# Altium project iMX53_BB_V1I2.PrjPcb (part 2 of 2)

## Sheet [08] - MMC SLOT.SchDoc: IMXBB
size A3; DocumentNumber: 8; Revision: 2.0; SheetNumber: 8; SheetTotal: 13
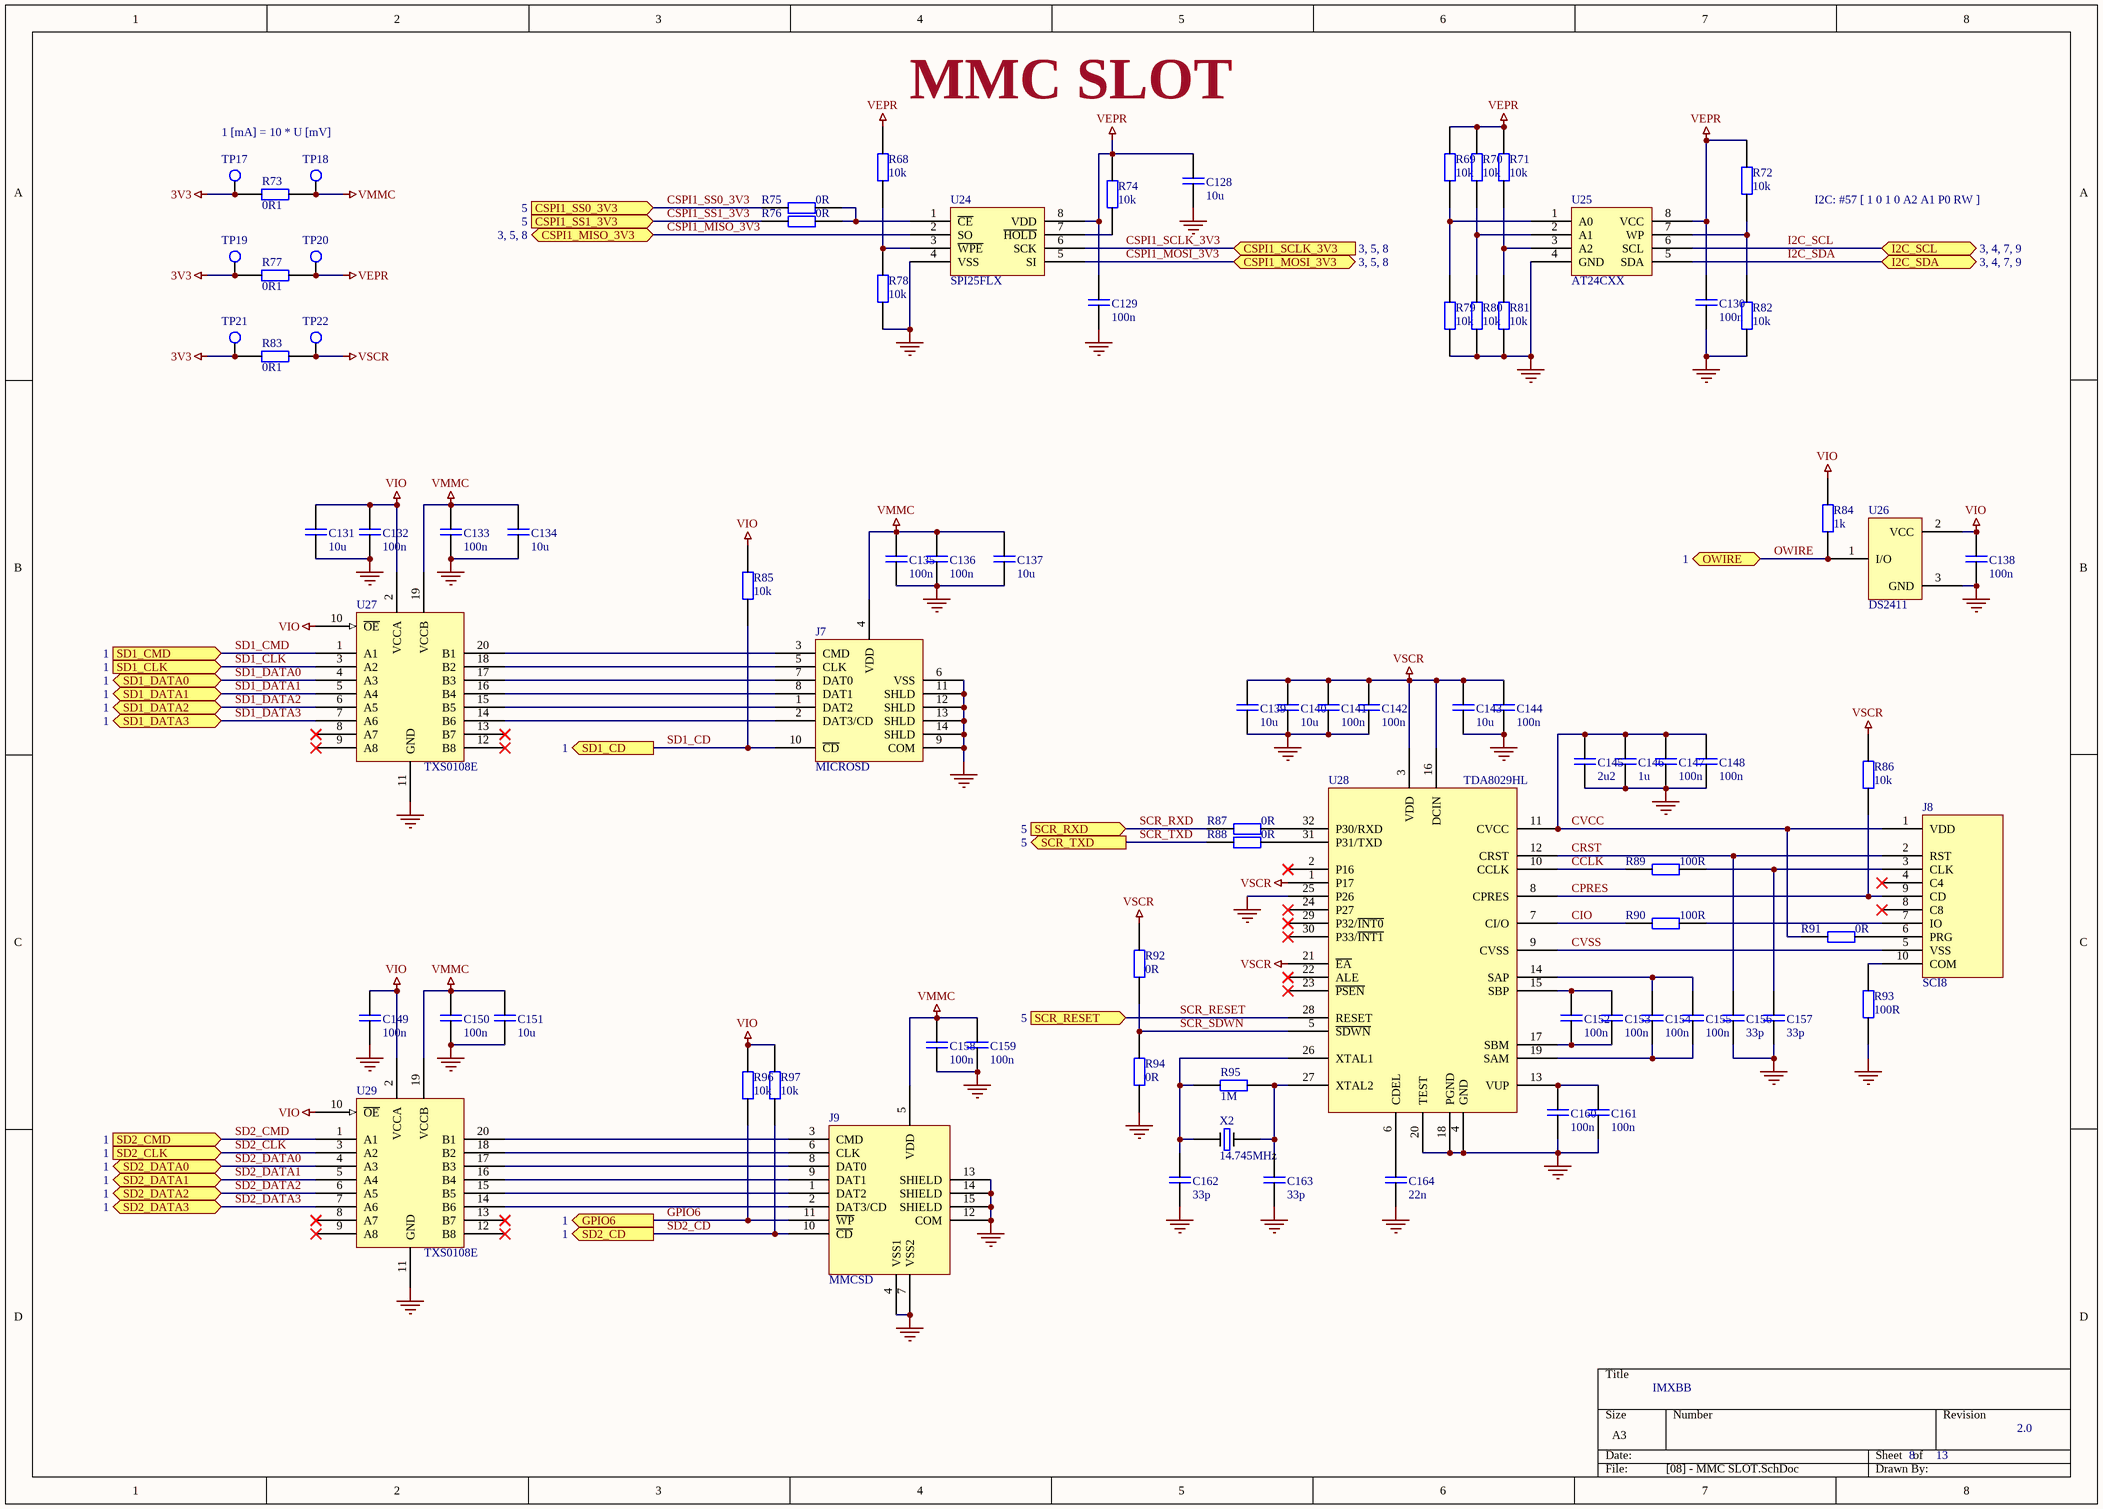
[diagram p8: [08] - MMC SLOT.SchDoc]

### Parts
C128  10u  [0805]
C129  100n  [0603]
C130  100n  [0603]
C131  10u  [0805]
C132  100n  [0603]
C133  100n  [0603]
C134  10u  [0805]
C135  100n  [0603]
C136  100n  [0603]
C137  10u  [0805]
C138  100n  [0603]
C139  10u  [0805]
C140  10u  [0805]
C141  100n  [0603]
C142  100n  [0603]
C143  10u  [0805]
C144  100n  [0603]
C145  2u2  [0603]
C146  1u  [0603]
C147  100n  [0603]
C148  100n  [0603]
C149  100n  [0603]
C150  100n  [0603]
C151  10u  [0805]
C152  100n  [0603]
C153  100n  [0603]
C154  100n  [0603]
C155  100n  [0603]
C156  33p  [0603]
C157  33p  [0603]
C158  100n  [0603]
C159  100n  [0603]
C160  100n  [0603]
C161  100n  [0603]
C162  33p  [0603]
C163  33p  [0603]
C164  22n  [0603]
J7  MICROSD  [uSD10]
J8  SCI8  [SCI8F]
J9  MMCSD  [SDCMF-109]
R68  10k  [0603]
R69  10k  [0603]
R70  10k  [0603]
R71  10k  [0603]
R72  10k  [0603]
R73  0R1  [0603]
R74  10k  [0603]
R75  0R  [0603]
R76  0R  [0603]
R77  0R1  [0603]
R78  10k  [0603]
R79  10k  [0603]
R80  10k  [0603]
R81  10k  [0603]
R82  10k  [0603]
R83  0R1  [0603]
R84  1k  [0603]
R85  10k  [0603]
R86  10k  [0603]
R87  0R  [0603]
R88  0R  [0603]
R89  100R  [0603]
R90  100R  [0603]
R91  0R  [0603]
R92  0R  [0603]
R93  100R  [0603]
R94  0R  [0603]
R95  1M  [0603]
R96  10k  [0603]
R97  10k  [0603]
TP17  TESTPOINT  [TESTPOINT_2mm]  (value not drawn)
TP18  TESTPOINT  [TESTPOINT_2mm]  (value not drawn)
TP19  TESTPOINT  [TESTPOINT_2mm]  (value not drawn)
TP20  TESTPOINT  [TESTPOINT_2mm]  (value not drawn)
TP21  TESTPOINT  [TESTPOINT_2mm]  (value not drawn)
TP22  TESTPOINT  [TESTPOINT_2mm]  (value not drawn)
U24  SPI25FLX  [SOIC8]
U25  AT24CXX  [SOIC8]
U26  DS2411  [SOT23]
U27  TXS0108E  [TSSOP20]
U28  TDA8029HL  [LQFP32]
U29  TXS0108E  [TSSOP20]
X2  14.745MHz  [HC494H]

### Ports
CSPI1_MISO_3V3 (bidir, see 3, 5, 8), CSPI1_MOSI_3V3 (bidir, see 3, 5, 8), CSPI1_SCLK_3V3 (in, see 3, 5, 8), CSPI1_SS0_3V3 (in, see 5), CSPI1_SS1_3V3 (in, see 5), GPIO6 (out, see 1), I2C_SCL (bidir, see 3, 4, 7, 9), I2C_SDA (bidir, see 3, 4, 7, 9), OWIRE (bidir, see 1), SCR_RESET (in, see 5), SCR_RXD (in, see 5), SCR_TXD (out, see 5), SD1_CD (out, see 1), SD1_CLK (in, see 1), SD1_CMD (in, see 1), SD1_DATA0 (bidir, see 1), SD1_DATA1 (bidir, see 1), SD1_DATA2 (bidir, see 1), SD1_DATA3 (bidir, see 1), SD2_CD (out, see 1), SD2_CLK (in, see 1), SD2_CMD (in, see 1), SD2_DATA0 (bidir, see 1), SD2_DATA1 (bidir, see 1), SD2_DATA2 (bidir, see 1), SD2_DATA3 (bidir, see 1)

### Nets
3V3: R73.1 R77.1 R83.1 TP17.1 TP19.1 TP21.1
GND: C128.1 C129.1 C130.1 C131.1 C132.1 C133.1 C134.1 C135.1 C136.1 C137.1 C138.1 C139.1 C140.1 C141.1 C142.1 C143.1 C144.1 C145.1 C146.1 C147.1 C148.1 C149.1 C150.1 C151.1 C156.1 C157.1 C158.1 C159.1 C160.1 C161.1 C162.1 C163.1 C164.1 J7.6(VSS) J7.9(COM) J7.11(SHLD) J7.12(SHLD) J7.13(SHLD) J7.14(SHLD) J9.4(VSS1) J9.7(VSS2) J9.12(COM) J9.13(SHIELD) J9.14(SHIELD) J9.15(SHIELD) R78.2 R79.2 R80.2 R81.2 R82.2 R93.1 R94.1 U24.4(VSS) U25.4(GND) U26.3(GND) U27.11(GND) U28.4(GND) U28.18(PGND) U28.20(TEST) U28.25(P26) U29.11(GND)
VEPR: C128.2 C129.2 C130.2 R68.1 R69.1 R70.1 R71.1 R72.1 R74.1 R77.2 TP20.1 U24.8(VDD) U25.8(VCC)
VIO: C131.2 C132.2 C138.2 C149.2 R84.1 R85.1 R96.1 R97.1 U26.2(VCC) U27.2(VCCA) U27.10(~{OE}) U29.2(VCCA) U29.10(~{OE})
VMMC: C133.2 C134.2 C135.2 C136.2 C137.2 C150.2 C151.2 C158.2 C159.2 J7.4(VDD) J9.5(VDD) R73.2 TP18.1 U27.19(VCCB) U29.19(VCCB)
VSCR: C139.2 C140.2 C141.2 C142.2 C143.2 C144.2 R83.2 R86.2 R92.2 TP22.1 U28.1(P17) U28.3(VDD) U28.16(DCIN) U28.21(~{EA})
CCLK: R89.1 U28.10(CCLK)
CIO: R90.1 U28.7(CI/O)
CPRES: J8.9(CD) R86.1 U28.8(CPRES)
CRST: C156.2 J8.2(RST) U28.12(CRST)
CSPI1_MISO_3V3: U24.2(SO) ; port CSPI1_MISO_3V3
CSPI1_MOSI_3V3: U24.5(SI) ; port CSPI1_MOSI_3V3
CSPI1_SCLK_3V3: U24.6(SCK) ; port CSPI1_SCLK_3V3
CSPI1_SS0_3V3: R75.1 ; port CSPI1_SS0_3V3
CSPI1_SS1_3V3: R76.1 ; port CSPI1_SS1_3V3
CVCC: C145.2 C146.2 C147.2 C148.2 J8.1(VDD) R91.1 U28.11(CVCC)
CVSS: J8.5(VSS) U28.9(CVSS)
GPIO6: J9.11(~{WP}) R96.2 ; port GPIO6
I2C_SCL: U25.6(SCL) ; port I2C_SCL
I2C_SDA: U25.5(SDA) ; port I2C_SDA
OWIRE: R84.2 U26.1(I/O) ; port OWIRE
SCR_RESET: U28.28(RESET) ; port SCR_RESET
SCR_RXD: R87.1 ; port SCR_RXD
SCR_SDWN: R92.1 R94.2 U28.5(~{SDWN})
SCR_TXD: R88.1 ; port SCR_TXD
SD1_CD: J7.10(~{CD}) R85.2 ; port SD1_CD
SD1_CLK: U27.3(A2) ; port SD1_CLK
SD1_CMD: U27.1(A1) ; port SD1_CMD
SD1_DATA0: U27.4(A3) ; port SD1_DATA0
SD1_DATA1: U27.5(A4) ; port SD1_DATA1
SD1_DATA2: U27.6(A5) ; port SD1_DATA2
SD1_DATA3: U27.7(A6) ; port SD1_DATA3
SD2_CD: J9.10(~{CD}) R97.2 ; port SD2_CD
SD2_CLK: U29.3(A2) ; port SD2_CLK
SD2_CMD: U29.1(A1) ; port SD2_CMD
SD2_DATA0: U29.4(A3) ; port SD2_DATA0
SD2_DATA1: U29.5(A4) ; port SD2_DATA1
SD2_DATA2: U29.6(A5) ; port SD2_DATA2
SD2_DATA3: U29.7(A6) ; port SD2_DATA3
NetC152_1: C152.1 C153.1 U28.17(SBM)
NetC152_2: C152.2 C153.2 U28.15(SBP)
NetC154_1: C154.1 C155.1 U28.19(SAM)
NetC154_2: C154.2 C155.2 U28.14(SAP)
NetC157_2: C157.2 J8.3(CLK) R89.2
NetC160_2: C160.2 C161.2 U28.13(VUP)
NetC162_2: C162.2 R95.2 U28.26(XTAL1) X2.1
NetC163_2: C163.2 R95.1 U28.27(XTAL2) X2.2
NetC164_2: C164.2 U28.6(CDEL)
NetJ7_1: J7.1(DAT2) U27.15(B5)
NetJ7_2: J7.2(DAT3/CD) U27.14(B6)
NetJ7_3: J7.3(CMD) U27.20(B1)
NetJ7_5: J7.5(CLK) U27.18(B2)
NetJ7_7: J7.7(DAT0) U27.17(B3)
NetJ7_8: J7.8(DAT1) U27.16(B4)
NetJ8_6: J8.6(PRG) R91.2
NetJ8_7: J8.7(IO) R90.2
NetJ8_10: J8.10(COM) R93.2
NetJ9_1: J9.1(DAT2) U29.15(B5)
NetJ9_2: J9.2(DAT3/CD) U29.14(B6)
NetJ9_3: J9.3(CMD) U29.20(B1)
NetJ9_6: J9.6(CLK) U29.18(B2)
NetJ9_8: J9.8(DAT0) U29.17(B3)
NetJ9_9: J9.9(DAT1) U29.16(B4)
NetR68_2: R68.2 R78.1 U24.3(~{WPE})
NetR69_2: R69.2 R79.1 U25.1(A0)
NetR70_2: R70.2 R80.1 U25.2(A1)
NetR71_2: R71.2 R81.1 U25.3(A2)
NetR72_2: R72.2 R82.1 U25.7(WP)
NetR74_2: R74.2 U24.7(~{HOLD})
NetR75_2: R75.2 R76.2 U24.1(~{CE})
NetR87_2: R87.2 U28.32(P30/RXD)
NetR88_2: R88.2 U28.31(P31/TXD)

Not connected (* = marked no-connect by the designer): J8 4(C4)* 8(C8)*; U27 8(A7)* 9(A8)* 12(B8)* 13(B7)*; U28 2(P16)* 22(ALE)* 23(~{PSEN})* 24(P27)* 29(P32/~{INT0})* 30(P33/~{INT1})*; U29 8(A7)* 9(A8)* 12(B8)* 13(B7)*

### Notes on the sheet
- MMC SLOT
- 1 [mA] = 10 * U [mV]
- I2C: #57 [ 1 0 1 0 A2 A1 P0 RW ]

### Library data of the parts
C128-C164 = C
R68-R97 = R
TP17-TP22 = TESTPOINT: as TP1 on sheet [03] - DIMM CON; Component class: TP; Producer: n/a; Assembly type: no component
X2 = XTAL

## Sheet [09] - DVI.SchDoc: IMXBB
size A3; DocumentNumber: 9; Revision: 2.0; SheetNumber: 9; SheetTotal: 13
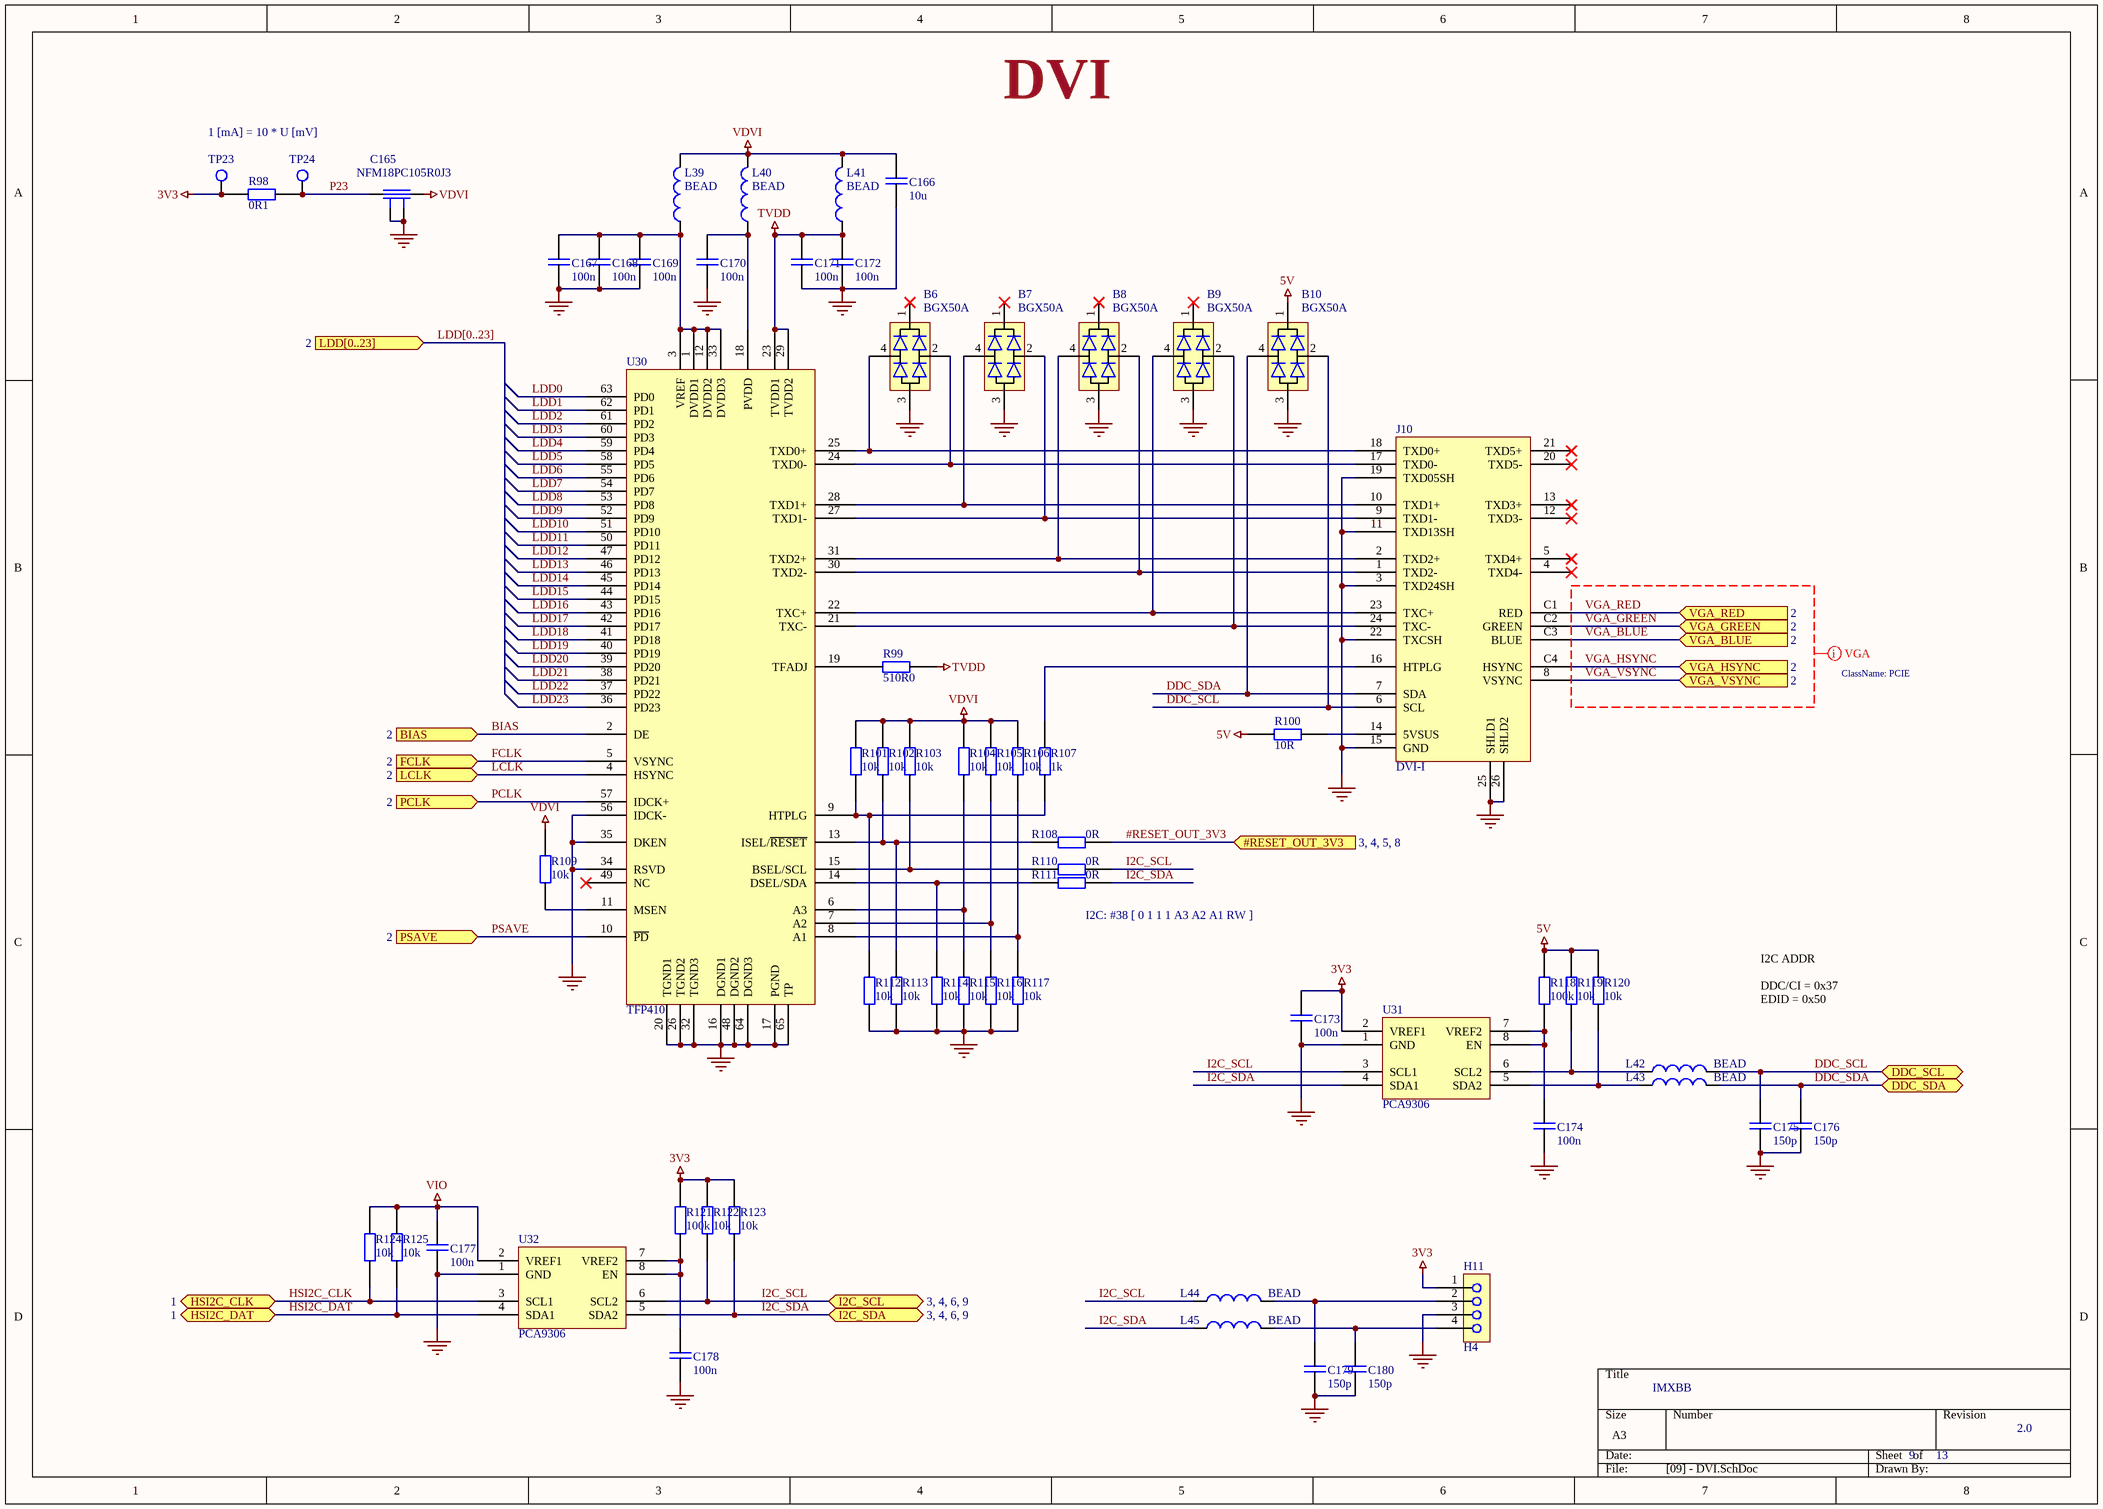
[diagram p9: [09] - DVI.SchDoc]

### Parts
B6  BGX50A  [SOT143]
B7  BGX50A  [SOT143]
B8  BGX50A  [SOT143]
B9  BGX50A  [SOT143]
B10  BGX50A  [SOT143]
C165  NFM18PC105R0J3  [NFM18P]
C166  10u  [0805]
C167  100n  [0603]
C168  100n  [0603]
C169  100n  [0603]
C170  100n  [0603]
C171  100n  [0603]
C172  100n  [0603]
C173  100n  [0603]
C174  100n  [0603]
C175  150p  [0603]
C176  150p  [0603]
C177  100n  [0603]
C178  100n  [0603]
C179  150p  [0603]
C180  150p  [0603]
H11  H4  [H1x4]
J10  DVI-I  [DVI_F_RA]
L39  BEAD  [0603]
L40  BEAD  [0603]
L41  BEAD  [0603]
L42  BEAD  [0603]
L43  BEAD  [0603]
L44  BEAD  [0603]
L45  BEAD  [0603]
R98  0R1  [0603]
R99  510R0  [0603]
R100  10R  [0603]
R101  10k  [0603]
R102  10k  [0603]
R103  10k  [0603]
R104  10k  [0603]
R105  10k  [0603]
R106  10k  [0603]
R107  1k  [0603]
R108  0R  [0603]
R109  10k  [0603]
R110  0R  [0603]
R111  0R  [0603]
R112  10k  [0603]
R113  10k  [0603]
R114  10k  [0603]
R115  10k  [0603]
R116  10k  [0603]
R117  10k  [0603]
R118  100k  [0603]
R119  10k  [0603]
R120  10k  [0603]
R121  100k  [0603]
R122  10k  [0603]
R123  10k  [0603]
R124  10k  [0603]
R125  10k  [0603]
TP23  TESTPOINT  [TESTPOINT_2mm]  (value not drawn)
TP24  TESTPOINT  [TESTPOINT_2mm]  (value not drawn)
U30  TFP410  [TQFP64]
U31  PCA9306  [TSSOP8]
U32  PCA9306  [TSSOP8]

### Ports
#RESET_OUT_3V3 (in, see 3, 4, 5, 8), BIAS (in, see 2), DDC_SCL (bidir), DDC_SDA (bidir), FCLK (in, see 2), HSI2C_CLK (bidir, see 1), HSI2C_DAT (bidir, see 1), I2C_SCL (bidir, see 3, 4, 6, 9), I2C_SDA (bidir, see 3, 4, 6, 9), LCLK (in, see 2), LDD[0..23] (in, see 2), PCLK (in, see 2), PSAVE (in, see 2), VGA_BLUE (in, see 2), VGA_GREEN (in, see 2), VGA_HSYNC (in, see 2), VGA_RED (in, see 2), VGA_VSYNC (in, see 2)

### Nets
3V3: C173.2 H11.1 R98.1 R121.1 R122.1 R123.1 TP23.1 U31.2(VREF1)
5V: B10.1 R100.2 R118.1 R119.1 R120.1
GND: B6.3 B7.3 B8.3 B9.3 B10.3 C165.2 C165.4 C166.1 C167.1 C168.1 C169.1 C170.1 C171.1 C172.1 C173.1 C174.1 C175.1 C176.1 C177.1 C178.1 C179.1 C180.1 H11.3 J10.3(TXD24SH) J10.11(TXD13SH) J10.15(GND) J10.19(TXD05SH) J10.22(TXCSH) J10.25(SHLD1) J10.26(SHLD2) R112.2 R113.2 R114.1 R115.2 R116.2 R117.2 U30.16(DGND1) U30.17(PGND) U30.20(TGND1) U30.26(TGND2) U30.32(TGND3) U30.34(RSVD) U30.35(DKEN) U30.48(DGND2) U30.56(IDCK-) U30.64(DGND3) U30.65(TP) U31.1(GND) U32.1(GND)
TVDD: C171.2 C172.2 L41.1 R99.1 U30.23(TVDD1) U30.29(TVDD2)
VDVI: C165.3 C166.2 L39.2 L40.2 L41.2 R101.1 R102.1 R103.1 R104.1 R105.1 R106.1 R109.1
VIO: C177.2 R124.1 R125.1 U32.2(VREF1)
#RESET_OUT_3V3: R108.1 ; port #RESET_OUT_3V3
BIAS: U30.2(DE) ; port BIAS
DDC_SCL: B10.2 C175.2 J10.6(SCL) L42.2 ; port DDC_SCL
DDC_SDA: B10.4 C176.2 J10.7(SDA) L43.2 ; port DDC_SDA
FCLK: U30.5(VSYNC) ; port FCLK
HSI2C_CLK: R124.2 U32.3(SCL1) ; port HSI2C_CLK
HSI2C_DAT: R125.2 U32.4(SDA1) ; port HSI2C_DAT
I2C_SCL: L44.1 R110.1 R122.2 U31.3(SCL1) U32.6(SCL2) ; port I2C_SCL
I2C_SDA: L45.1 R111.1 R123.2 U31.4(SDA1) U32.5(SDA2) ; port I2C_SDA
LCLK: U30.4(HSYNC) ; port LCLK
LDD0: U30.63(PD0)
LDD1: U30.62(PD1)
LDD2: U30.61(PD2)
LDD3: U30.60(PD3)
LDD4: U30.59(PD4)
LDD5: U30.58(PD5)
LDD6: U30.55(PD6)
LDD7: U30.54(PD7)
LDD8: U30.53(PD8)
LDD9: U30.52(PD9)
LDD10: U30.51(PD10)
LDD11: U30.50(PD11)
LDD12: U30.47(PD12)
LDD13: U30.46(PD13)
LDD14: U30.45(PD14)
LDD15: U30.44(PD15)
LDD16: U30.43(PD16)
LDD17: U30.42(PD17)
LDD18: U30.41(PD18)
LDD19: U30.40(PD19)
LDD20: U30.39(PD20)
LDD21: U30.38(PD21)
LDD22: U30.37(PD22)
LDD23: U30.36(PD23)
P23: C165.1 R98.2 TP24.1
PCLK: U30.57(IDCK+) ; port PCLK
PSAVE: U30.10(~{PD}) ; port PSAVE
VGA_BLUE: J10.C3(BLUE) ; port VGA_BLUE
VGA_GREEN: J10.C2(GREEN) ; port VGA_GREEN
VGA_HSYNC: J10.C4(HSYNC) ; port VGA_HSYNC
VGA_RED: J10.C1(RED) ; port VGA_RED
VGA_VSYNC: J10.8(VSYNC) ; port VGA_VSYNC
NetB6_2: B6.2 J10.17(TXD0-) U30.24(TXD0-)
NetB6_4: B6.4 J10.18(TXD0+) U30.25(TXD0+)
NetB7_2: B7.2 J10.9(TXD1-) U30.27(TXD1-)
NetB7_4: B7.4 J10.10(TXD1+) U30.28(TXD1+)
NetB8_2: B8.2 J10.1(TXD2-) U30.30(TXD2-)
NetB8_4: B8.4 J10.2(TXD2+) U30.31(TXD2+)
NetB9_2: B9.2 J10.24(TXC-) U30.21(TXC-)
NetB9_4: B9.4 J10.23(TXC+) U30.22(TXC+)
NetC167_2: C167.2 C168.2 C169.2 L39.1 U30.1(DVDD1) U30.3(VREF) U30.12(DVDD2) U30.33(DVDD3)
NetC170_2: C170.2 L40.1 U30.18(PVDD)
NetC174_2: C174.2 R118.2 U31.7(VREF2) U31.8(EN)
NetC178_2: C178.2 R121.2 U32.7(VREF2) U32.8(EN)
NetC179_2: C179.2 H11.2 L44.2
NetC180_2: C180.2 H11.4 L45.2
NetJ10_14: J10.14(5VSUS) R100.1
NetJ10_16: J10.16(HTPLG) R107.1
NetL42_1: L42.1 R119.2 U31.6(SCL2)
NetL43_1: L43.1 R120.2 U31.5(SDA2)
NetR99_2: R99.2 U30.19(TFADJ)
NetR101_2: R101.2 R107.2 R112.1 U30.9(HTPLG)
NetR102_2: R102.2 R108.2 R113.1 U30.13(ISEL/~{RESET})
NetR103_2: R103.2 R110.2 U30.15(BSEL/SCL)
NetR104_2: R104.2 R115.1 U30.6(A3)
NetR105_2: R105.2 R116.1 U30.7(A2)
NetR106_2: R106.2 R117.1 U30.8(A1)
NetR109_2: R109.2 U30.11(MSEN)
NetR111_2: R111.2 R114.2 U30.14(DSEL/SDA)

Not connected (* = marked no-connect by the designer): B6 1*; B7 1*; B8 1*; B9 1*; J10 4(TXD4-)* 5(TXD4+)* 12(TXD3-)* 13(TXD3+)* 20(TXD5-)* 21(TXD5+)*; U30 49(NC)*

### Buses and harness runs
bus LDD[0..23] = port LDD[0..23]

### Layout directives
net class PCIE: VGA_BLUE, VGA_GREEN, VGA_HSYNC, VGA_RED, VGA_VSYNC

### Notes on the sheet
- DVI
- 1 [mA] = 10 * U [mV]
- I2C: #38 [ 0 1 1 1 A3 A2 A1 RW ]
- I2C ADDR
  DDC/CI	= 0x37
  EDID	= 0x50

### Library data of the parts
C165 = NFL21S: Chip EMIFIL; Producer: Murata; Order number: NFM18PC105R0J3; Component class: C; Assembly type: SMT
C166-C180 = C
L39-L45 = FBEAD
R98-R125 = R
TP23 TP24 = TESTPOINT: Testpoint pad; Order number: no component; Component class: TP; Producer: n/a; Assembly type: no component

## Sheet [10] - ETHERNET.SchDoc: IMXBB
size A3; DocumentNumber: 10; Revision: 2.0; SheetNumber: 10; SheetTotal: 13
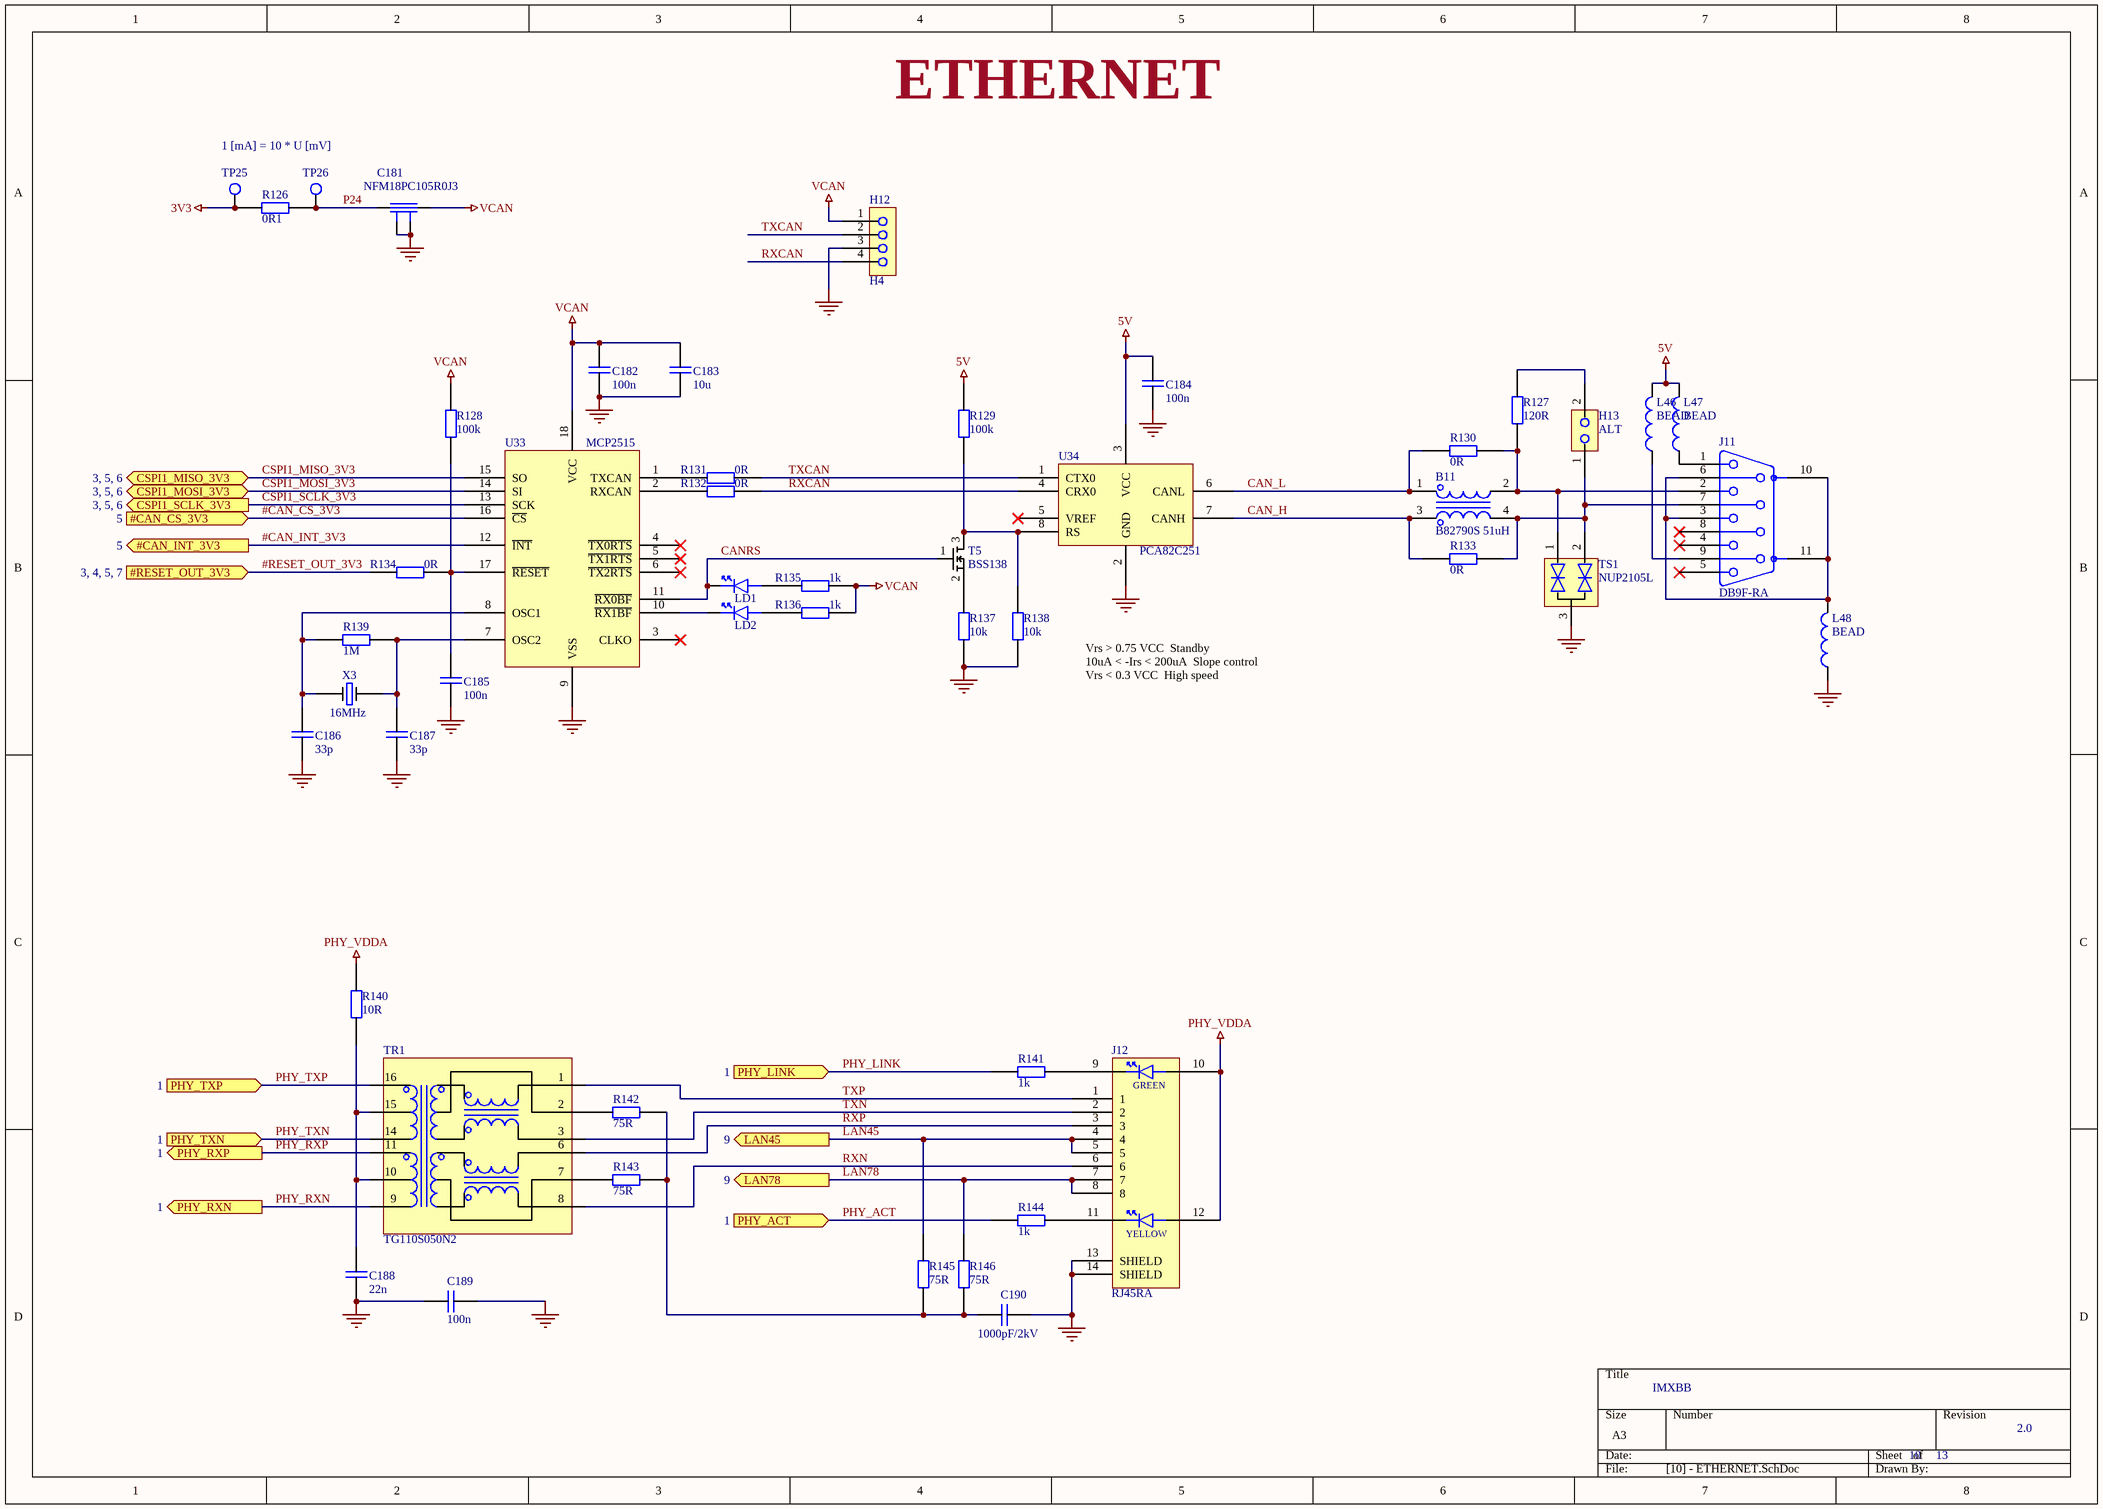
[diagram p10: [10] - ETHERNET.SchDoc]

### Parts
B11  B82790S 51uH  [B82790]
C181  NFM18PC105R0J3  [NFM18P]
C182  100n  [0603]
C183  10u  [0805]
C184  100n  [0603]
C185  100n  [0603]
C186  33p  [0603]
C187  33p  [0603]
C188  22n  [0603]
C189  100n  [0603]
C190  1000pF/2kV  [1n]
H12  H4  [H1x4]
H13  ALT  [H1x2]
J11  DB9F-RA  [DRA9_F]
J12  RJ45RA  [RJ45LED]
L46  BEAD  [0805]
L47  BEAD  [0805]
L48  BEAD  [0603]
LD1  LED  [0805]  (value not drawn)
LD2  LED  [0805]  (value not drawn)
R126  0R1  [0603]
R127  120R  [0603]
R128  100k  [0603]
R129  100k  [0603]
R130  0R  [0603]
R131  0R  [0603]
R132  0R  [0603]
R133  0R  [0603]
R134  0R  [0603]
R135  1k  [0603]
R136  1k  [0603]
R137  10k  [0603]
R138  10k  [0603]
R139  1M  [0603]
R140  10R  [0603]
R141  1k  [0603]
R142  75R  [0603]
R143  75R  [0603]
R144  1k  [0603]
R145  75R  [0603]
R146  75R  [0603]
T5  BSS138  [SOT23]
TP25  TESTPOINT  [TESTPOINT_2mm]  (value not drawn)
TP26  TESTPOINT  [TESTPOINT_2mm]  (value not drawn)
TR1  TG110S050N2  [SOIC16M]
TS1  NUP2105L  [SOT23]
U33  MCP2515  [SOIC18W]
U34  PCA82C251  [SOIC8N]
X3  16MHz  [HC494H]

### Ports
#CAN_CS_3V3 (in, see 5), #CAN_INT_3V3 (out, see 5), #RESET_OUT_3V3 (in, see 3, 4, 5, 7), CSPI1_MISO_3V3 (bidir, see 3, 5, 6), CSPI1_MOSI_3V3 (bidir, see 3, 5, 6), CSPI1_SCLK_3V3 (out, see 3, 5, 6), LAN45 (out, see 9), LAN78 (out, see 9), PHY_ACT (in, see 1), PHY_LINK (in, see 1), PHY_RXN (out, see 1), PHY_RXP (out, see 1), PHY_TXN (in, see 1), PHY_TXP (in, see 1)

### Nets
3V3: R126.1 TP25.1
5V: C184.2 L46.2 L47.2 R129.1 U34.3(VCC)
CASE_GND: C189.1 C190.2 J12.13(SHIELD) J12.14(SHIELD)
GND: C181.2 C181.4 C182.1 C183.1 C184.1 C185.1 C186.1 C187.1 C188.1 C189.2 H12.3 L48.1 R137.2 R138.2 TS1.3 U33.9(VSS) U34.2(GND)
PHY_VDDA: J12.10(D1P) J12.12(D2P) R140.2
VCAN: C181.3 C182.2 C183.2 H12.1 R128.1 R135.1 R136.1 U33.18(VCC)
#CAN_CS_3V3: U33.16(~{CS}) ; port #CAN_CS_3V3
#CAN_INT_3V3: U33.12(~{INT}) ; port #CAN_INT_3V3
#RESET_OUT_3V3: R134.2 ; port #RESET_OUT_3V3
CAN_H: B11.3 R133.1 U34.7(CANH)
CAN_L: B11.1 R130.1 U34.6(CANL)
CANRS: LD1.2(CATHODE) T5.1(G) U33.11(~{RX0BF})
CSPI1_MISO_3V3: U33.15(SO) ; port CSPI1_MISO_3V3
CSPI1_MOSI_3V3: U33.14(SI) ; port CSPI1_MOSI_3V3
CSPI1_SCLK_3V3: U33.13(SCK) ; port CSPI1_SCLK_3V3
LAN45: J12.4 J12.5 R145.2 ; port LAN45
LAN78: J12.7 J12.8 R146.2 ; port LAN78
P24: C181.1 R126.2 TP26.1
PHY_ACT: R144.1 ; port PHY_ACT
PHY_LINK: R141.1 ; port PHY_LINK
PHY_RXN: TR1.9(P10) ; port PHY_RXN
PHY_RXP: TR1.11(P12) ; port PHY_RXP
PHY_TXN: TR1.14(P14) ; port PHY_TXN
PHY_TXP: TR1.16(P16) ; port PHY_TXP
RXCAN: H12.4 R132.1 U34.4(CRX0)
RXN: J12.6 TR1.8(P8)
RXP: J12.3 TR1.6(P6)
TXCAN: H12.2 R131.1 U34.1(CTX0)
TXN: J12.2 TR1.3(P3)
TXP: J12.1 TR1.1(P1)
NetB11_2: B11.2 J11.2 R127.2 R130.2 TS1.1
NetB11_4: B11.4 H13.1 J11.7 R133.2 TS1.2
NetC185_2: C185.2 R128.2 R134.1 U33.17(~{RESET})
NetC186_2: C186.2 R139.2 U33.8(OSC1) X3.1
NetC187_2: C187.2 R139.1 U33.7(OSC2) X3.2
NetC188_2: C188.2 R140.1 TR1.10(P11) TR1.15(CT)
NetC190_1: C190.1 R142.2 R143.2 R145.1 R146.1
NetH13_2: H13.2 R127.1
NetJ11_1: J11.1 L47.1
NetJ11_3: J11.3 J11.6 J11.10(SHIELD) J11.11(SHIELD) L48.2
NetJ11_9: J11.9 L46.1
NetJ12_9: J12.9(D1N) R141.2
NetJ12_11: J12.11(D2N) R144.2
NetLD1_1: LD1.1(ANODE) R135.2
NetLD2_1: LD2.1(ANODE) R136.2
NetLD2_2: LD2.2(CATHODE) U33.10(~{RX1BF})
NetR129_2: R129.2 R138.1 T5.3(D) U34.8(RS)
NetR131_2: R131.2 U33.1(TXCAN)
NetR132_2: R132.2 U33.2(RXCAN)
NetR137_1: R137.1 T5.2(S)
NetR142_1: R142.1 TR1.2(P2)
NetR143_1: R143.1 TR1.7(P7)

Not connected (* = marked no-connect by the designer): J11 4* 5* 8*; U33 3(CLKO)* 4(~{TX0RTS})* 5(~{TX1RTS})* 6(~{TX2RTS})*; U34 5(VREF)*

### Notes on the sheet
- ETHERNET
- 1 [mA] = 10 * U [mV]
- Vrs > 0.75 VCC		Standby
  10uA < -Irs < 200uA		Slope control
  Vrs < 0.3 VCC		High speed
- (in symbol RJ45RA) GREEN; YELLOW

### Library data of the parts
B11 = B82790S: pin to pad: 3>4 4>3
C181 = NFL21S: Chip EMIFIL; Producer: Murata; Order number: NFM18PC105R0J3; Component class: C; Assembly type: SMT
C182-C190 = C
H13 = H2
L46-L48 = FBEAD
R126-R146 = R
TP25 TP26 = TESTPOINT: as TP23 on sheet [09] - DVI; Component class: TP; Producer: n/a; Assembly type: no component
X3 = XTAL

## Sheet [11] - POWERS.SchDoc: IMXBB
size A3; DocumentNumber: 11; Revision: 2.0; SheetNumber: 11; SheetTotal: 13
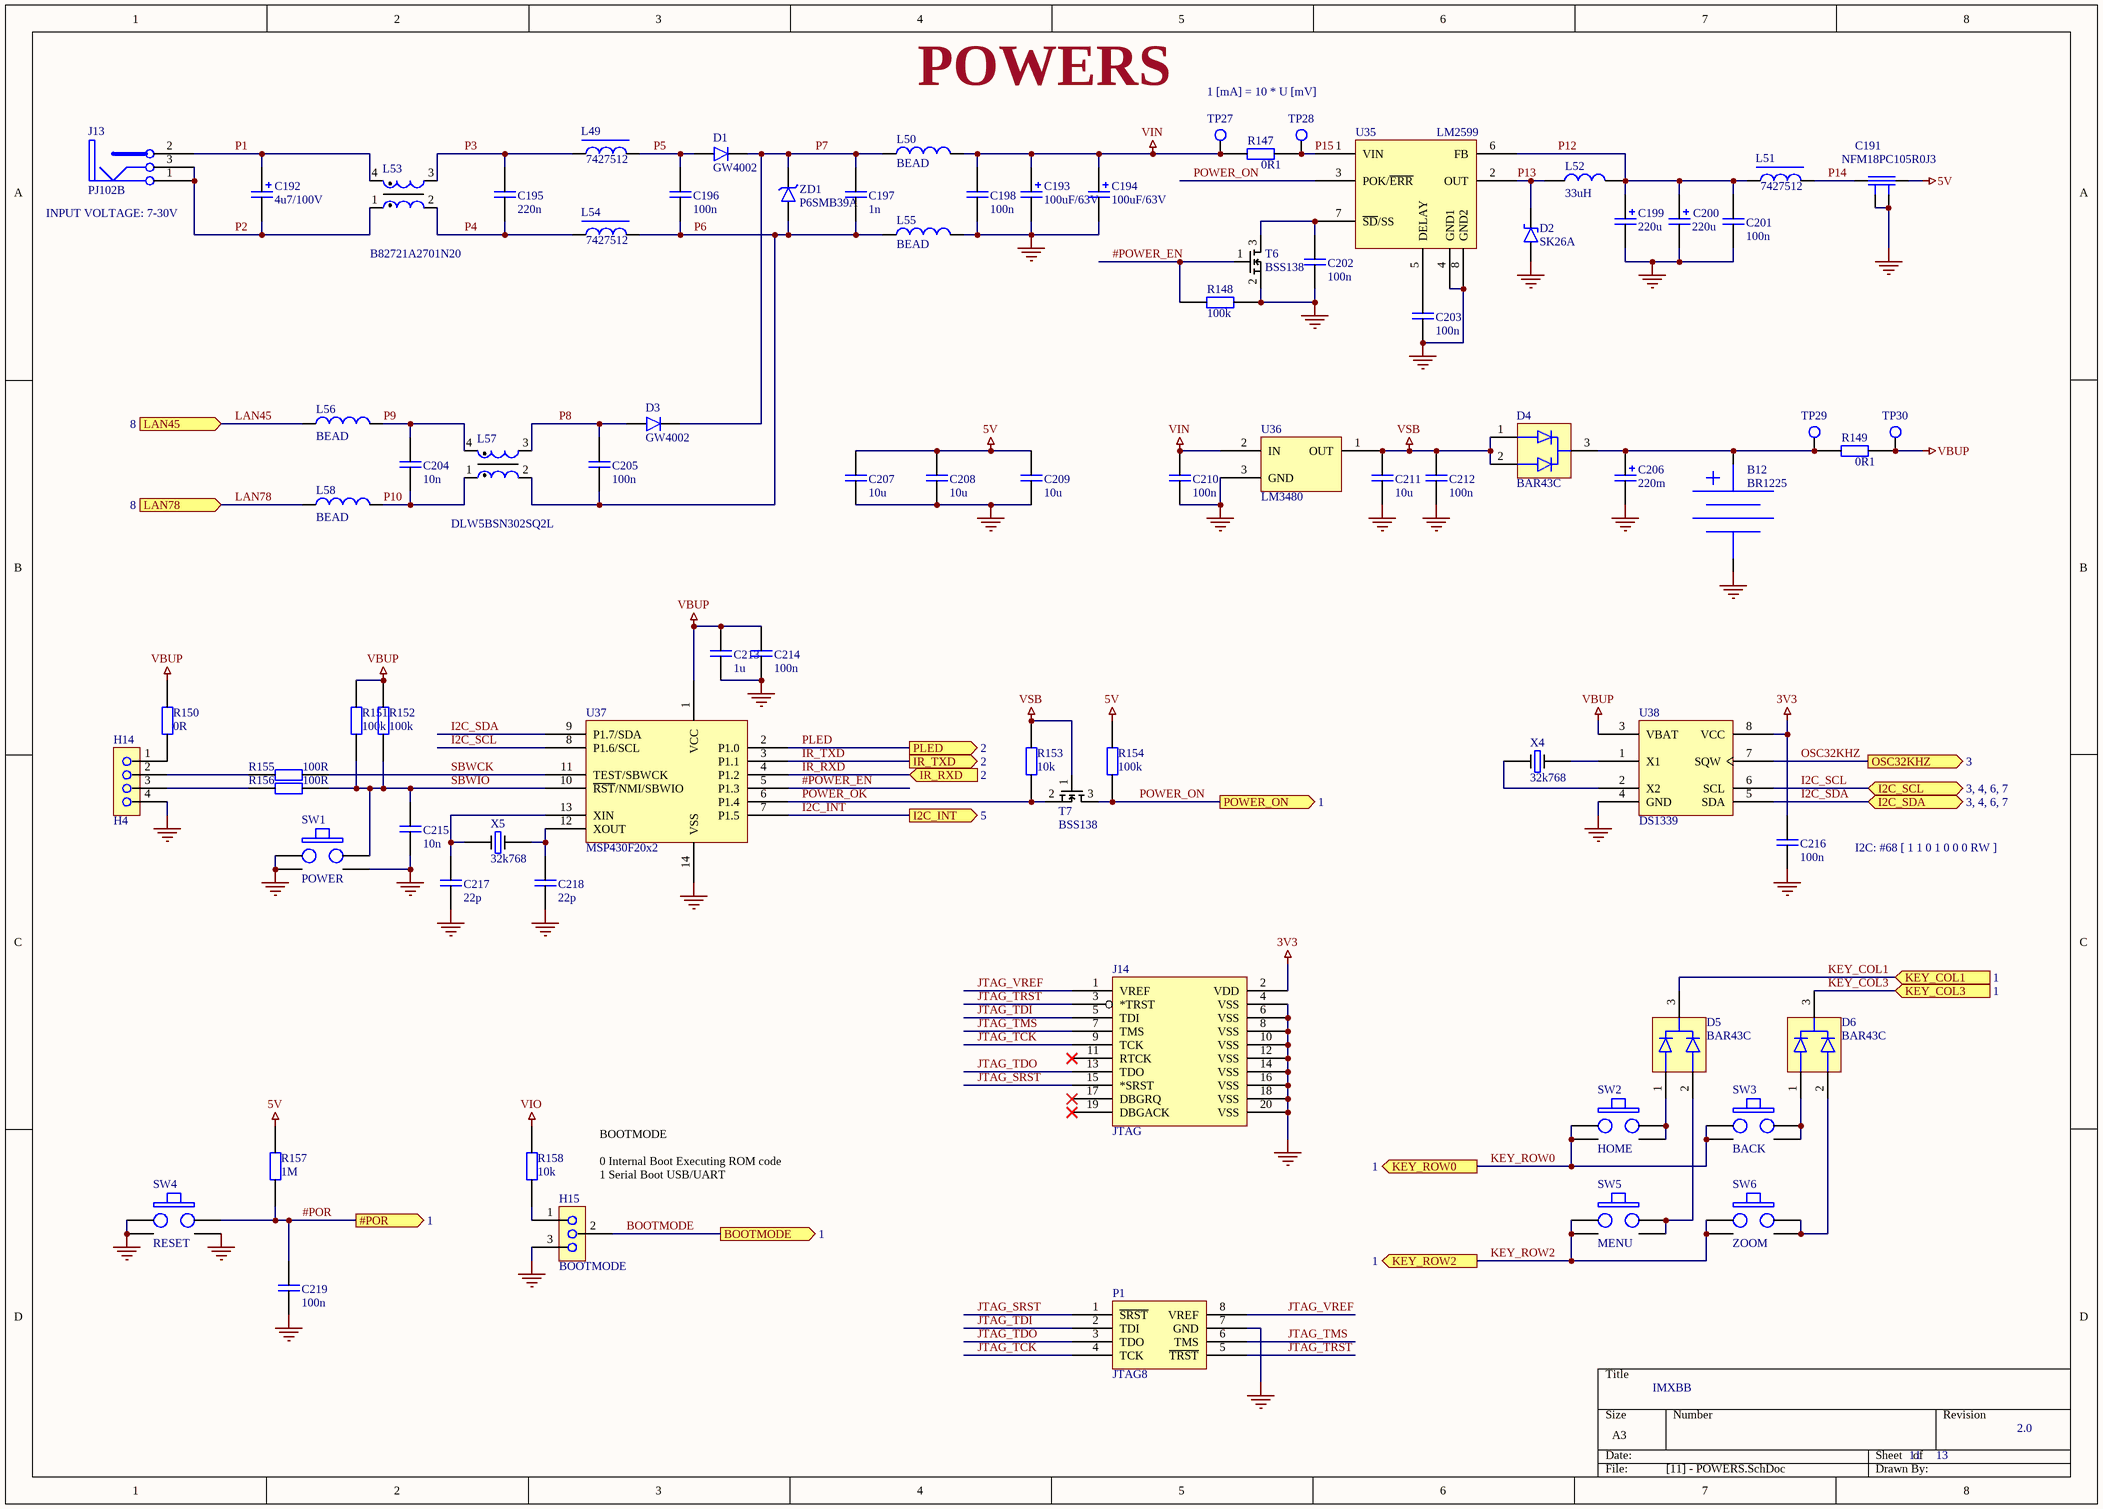
[diagram p11: [11] - POWERS.SchDoc]

### Parts
B12  BR1225  [BR1225]
C191  NFM18PC105R0J3  [NFM18P]
C192  4u7/100V  [EC2/5]
C193  100uF/63V  [EC5/10]
C194  100uF/63V  [EC5/10]
C195  220n  [1206]
C196  100n  [1206]
C197  1n  [0805]
C198  100n  [1206]
C199  220u  [EC5/10]
C200  220u  [EC5/10]
C201  100n  [0603]
C202  100n  [0603]
C203  100n  [0603]
C204  10n  [0603]
C205  100n  [0603]
C206  220m  [SC5/13]
C207  10u  [0805]
C208  10u  [0805]
C209  10u  [0805]
C210  100n  [0603]
C211  10u  [0805]
C212  100n  [0603]
C213  1u  [0603]
C214  100n  [0603]
C215  10n  [0603]
C216  100n  [0603]
C217  22p  [0603]
C218  22p  [0603]
C219  100n  [0603]
D1  GW4002  [MELF]
D2  SK26A  [SMB]
D3  GW4002  [MELF]
D4  BAR43C  [SOT23]
D5  BAR43C  [SOT23]
D6  BAR43C  [SOT23]
H14  H4  [H1x4]
H15  BOOTMODE  [H1x3]
J13  PJ102B  [POWER_JACK_5.5/2.1MM_NS]
J14  JTAG  [H2x10]
L49  7427512  [7427512]
L50  BEAD  [0805]
L51  7427512  [7427512]
L52  33uH  [L127_NS]
L53  B82721A2701N20  [42H17]
L54  7427512  [7427512]
L55  BEAD  [0805]
L56  BEAD  [0805]
L57  DLW5BSN302SQ2L  [DLW5BSN]
L58  BEAD  [0805]
P1  JTAG8  [47041-0001]
R147  0R1  [0603]
R148  100k  [0603]
R149  0R1  [0603]
R150  0R  [0603]
R151  100k  [0603]
R152  100k  [0603]
R153  10k  [0603]
R154  100k  [0603]
R155  100R  [0603]
R156  100R  [0603]
R157  1M  [0603]
R158  10k  [0603]
SW1  POWER  [BUTTON_RA_NS]
SW2  HOME  [BUTTON_KSM61X]
SW3  BACK  [BUTTON_KSM61X]
SW4  RESET  [BUTTON_RA_NS]
SW5  MENU  [BUTTON_KSM61X]
SW6  ZOOM  [BUTTON_KSM61X]
T6  BSS138  [SOT23]
T7  BSS138  [SOT23]
TP27  TESTPOINT  [TESTPOINT_2mm]  (value not drawn)
TP28  TESTPOINT  [TESTPOINT_2mm]  (value not drawn)
TP29  TESTPOINT  [TESTPOINT_2mm]  (value not drawn)
TP30  TESTPOINT  [TESTPOINT_2mm]  (value not drawn)
U35  LM2599  [TO263_7]
U36  LM3480  [SOT23]
U37  MSP430F20x2  [TSSOP14]
U38  DS1339  [uSOP8]
X4  32k768  [SMQ32S]
X5  32k768  [SMQ32S]
ZD1  P6SMB39A  [DO214AA]

### Ports
#POR (out, see 1), BOOTMODE (out, see 1), I2C_INT (out, see 5), I2C_SCL (bidir, see 3, 4, 6, 7), I2C_SDA (bidir, see 3, 4, 6, 7), IR_RXD (in, see 2), IR_TXD (out, see 2), KEY_COL1 (in, see 1), KEY_COL3 (in, see 1), KEY_ROW0 (out, see 1), KEY_ROW2 (out, see 1), LAN45 (in, see 8), LAN78 (in, see 8), OSC32KHZ (out, see 3), PLED (out, see 2), POWER_ON (out, see 1)

### Nets
3V3: C216.2 J14.2(VDD) U38.8(VCC)
5V: C191.3 C207.2 C208.2 C209.2 R154.2 R157.2
GND: B12.2(CATHODE) C191.2 C191.4 C193.2 C194.2 C198.2 C199.2 C200.2 C201.2 C202.1 C203.1 C206.2 C207.1 C208.1 C209.1 C210.1 C211.1 C212.1 C213.1 C214.2 C215.2 C216.1 C217.1 C218.1 C219.1 D2.2 H14.4 H15.3 J14.4(VSS) J14.6(VSS) J14.8(VSS) J14.10(VSS) J14.12(VSS) J14.14(VSS) J14.16(VSS) J14.18(VSS) J14.20(VSS) L55.1 P1.7(GND) R148.1 SW1.2 SW1.3 SW1.4 SW4.2 SW4.3 SW4.4 T6.2(S) U35.4(GND1) U35.8(GND2) U36.3(GND) U37.14(VSS) U38.4(GND)
VBUP: C213.2 C214.1 R149.2 R150.2 R151.2 R152.2 TP30.1 U37.1(VCC) U38.3(VBAT)
VIN: C193.1 C194.1 C198.1 C210.2 L50.1 R147.1 TP27.1 U36.2(IN)
VIO: R158.2
VSB: C211.2 C212.2 D4.1 D4.2 R153.1 T7.1(G) U36.1(OUT)
#POR: C219.2 R157.1 SW4.1 ; port #POR
#POWER_EN: R148.2 T6.1(G) U37.5(P1.3)
BOOTMODE: H15.2 ; port BOOTMODE
I2C_INT: U37.7(P1.5) ; port I2C_INT
I2C_SCL: U37.8(P1.6/SCL) U38.6(SCL) ; port I2C_SCL
I2C_SDA: U37.9(P1.7/SDA) U38.5(SDA) ; port I2C_SDA
IR_RXD: U37.4(P1.2) ; port IR_RXD
IR_TXD: U37.3(P1.1) ; port IR_TXD
JTAG_SRST: J14.15(*SRST) P1.1(~{SRST})
JTAG_TCK: J14.9(TCK) P1.4(TCK)
JTAG_TDI: J14.5(TDI) P1.2(TDI)
JTAG_TDO: J14.13(TDO) P1.3(TDO)
JTAG_TMS: J14.7(TMS) P1.6(TMS)
JTAG_TRST: J14.3(*TRST) P1.5(~{TRST})
JTAG_VREF: J14.1(VREF) P1.8(VREF)
KEY_COL1: D5.3 ; port KEY_COL1
KEY_COL3: D6.3 ; port KEY_COL3
KEY_ROW0: SW2.1 SW2.3 SW3.1 SW3.3 ; port KEY_ROW0
KEY_ROW2: SW5.1 SW5.3 SW6.1 SW6.3 ; port KEY_ROW2
LAN45: L56.1 ; port LAN45
LAN78: L58.1 ; port LAN78
OSC32KHZ: U38.7(SQW) ; port OSC32KHZ
P1: C192.1 J13.2 L53.4
P2: C192.2 J13.1 J13.3 L53.1
P3: C195.1 L49.2 L53.3
P4: C195.2 L53.2 L54.2
P5: C196.1 D1.1 L49.1
P6: C196.2 C197.2 C205.2 L54.1 L55.2 L57.2 ZD1.2
P7: C197.1 D1.2 D3.2 L50.2 ZD1.1
P8: C205.1 D3.1 L57.3
P9: C204.1 L56.2 L57.4
P10: C204.2 L57.1 L58.2
P12: C199.1 C200.1 C201.1 L51.2 L52.2 U35.6(FB)
P13: D2.1 L52.1 U35.2(OUT)
P14: C191.1 L51.1
P15: R147.2 TP28.1 U35.1(VIN)
PLED: U37.2(P1.0) ; port PLED
POWER_OK: R153.2 T7.2(S) U37.6(P1.4)
POWER_ON: R154.1 T7.3(D) U35.3(POK/~{ERR}) ; port POWER_ON
SBWCK: R155.2 U37.11(TEST/SBWCK)
SBWIO: C215.1 R151.1 R152.1 R156.2 SW1.1 U37.10(~{RST}/NMI/SBWIO)
NetB12_1: B12.1(ANODE) C206.1 D4.3 R149.1 TP29.1
NetC202_2: C202.2 T6.3(D) U35.7(~{SD}/SS)
NetC203_2: C203.2 U35.5(DELAY)
NetC217_2: C217.2 U37.13(XIN) X5.1
NetC218_2: C218.2 U37.12(XOUT) X5.2
NetD5_1: D5.1 SW2.2 SW2.4
NetD5_2: D5.2 SW5.2 SW5.4
NetD6_1: D6.1 SW3.2 SW3.4
NetD6_2: D6.2 SW6.2 SW6.4
NetH14_1: H14.1 R150.1
NetH14_2: H14.2 R155.1
NetH14_3: H14.3 R156.1
NetH15_1: H15.1 R158.1
NetU38_1: U38.1(X1) X4.2
NetU38_2: U38.2(X2) X4.1

Not connected (* = marked no-connect by the designer): J14 11(RTCK)* 17(DBGRQ)* 19(DBGACK)*

### Notes on the sheet
- POWERS
- 1 [mA] = 10 * U [mV]
- (near J13) INPUT VOLTAGE: 7-30V
- I2C: #68 [ 1 1 0 1 0 0 0 RW ]
- (near H15) BOOTMODE
  0	Internal Boot	Executing ROM code
  1	Serial Boot	USB/UART

### Library data of the parts
B12 = BATT3V
C191 = NFL21S: Chip EMIFIL; Producer: Murata; Order number: NFM18PC105R0J3; Component class: C; Assembly type: SMT
C192-C194 C199 C200 C206 = C+
C195-C198 C201-C205 C207-C219 = C
D1 D3 = D
D2 = SHD
H15 = H3
J14 = ARMICE20
L49 L51 L54 = 7427512: 5A EMI ferit L; Producer: Wurth Electronic; Order number: 7427512; Component class: L; Assembly type: SMT
L50 L55 L56 L58 = FBEAD
L52 = L
L53 = 42H17: Current compensated choke 2x10mH/700mA; Producer: Epcos; Component class: L; Assembly type: TH; Order number: B82721A2701N20
L57 = DLW5BSN152SQ2L: EMI Suppression filter 1A; Producer: Murata; Component class: L; Assembly type: SMT; Order number: DLW5BSN302SQ2L
R147-R158 = R
SW1-SW6 = PBSW
TP27-TP30 = TESTPOINT: as TP23 on sheet [09] - DVI; Component class: TP; Producer: n/a; Assembly type: no component
X4 X5 = XTAL
ZD1 = ZD

## Sheet [12] - DOC REVISION HISTORY.SchDoc
size A3; DocumentNumber: 12; SheetNumber: 12; SheetTotal: 13
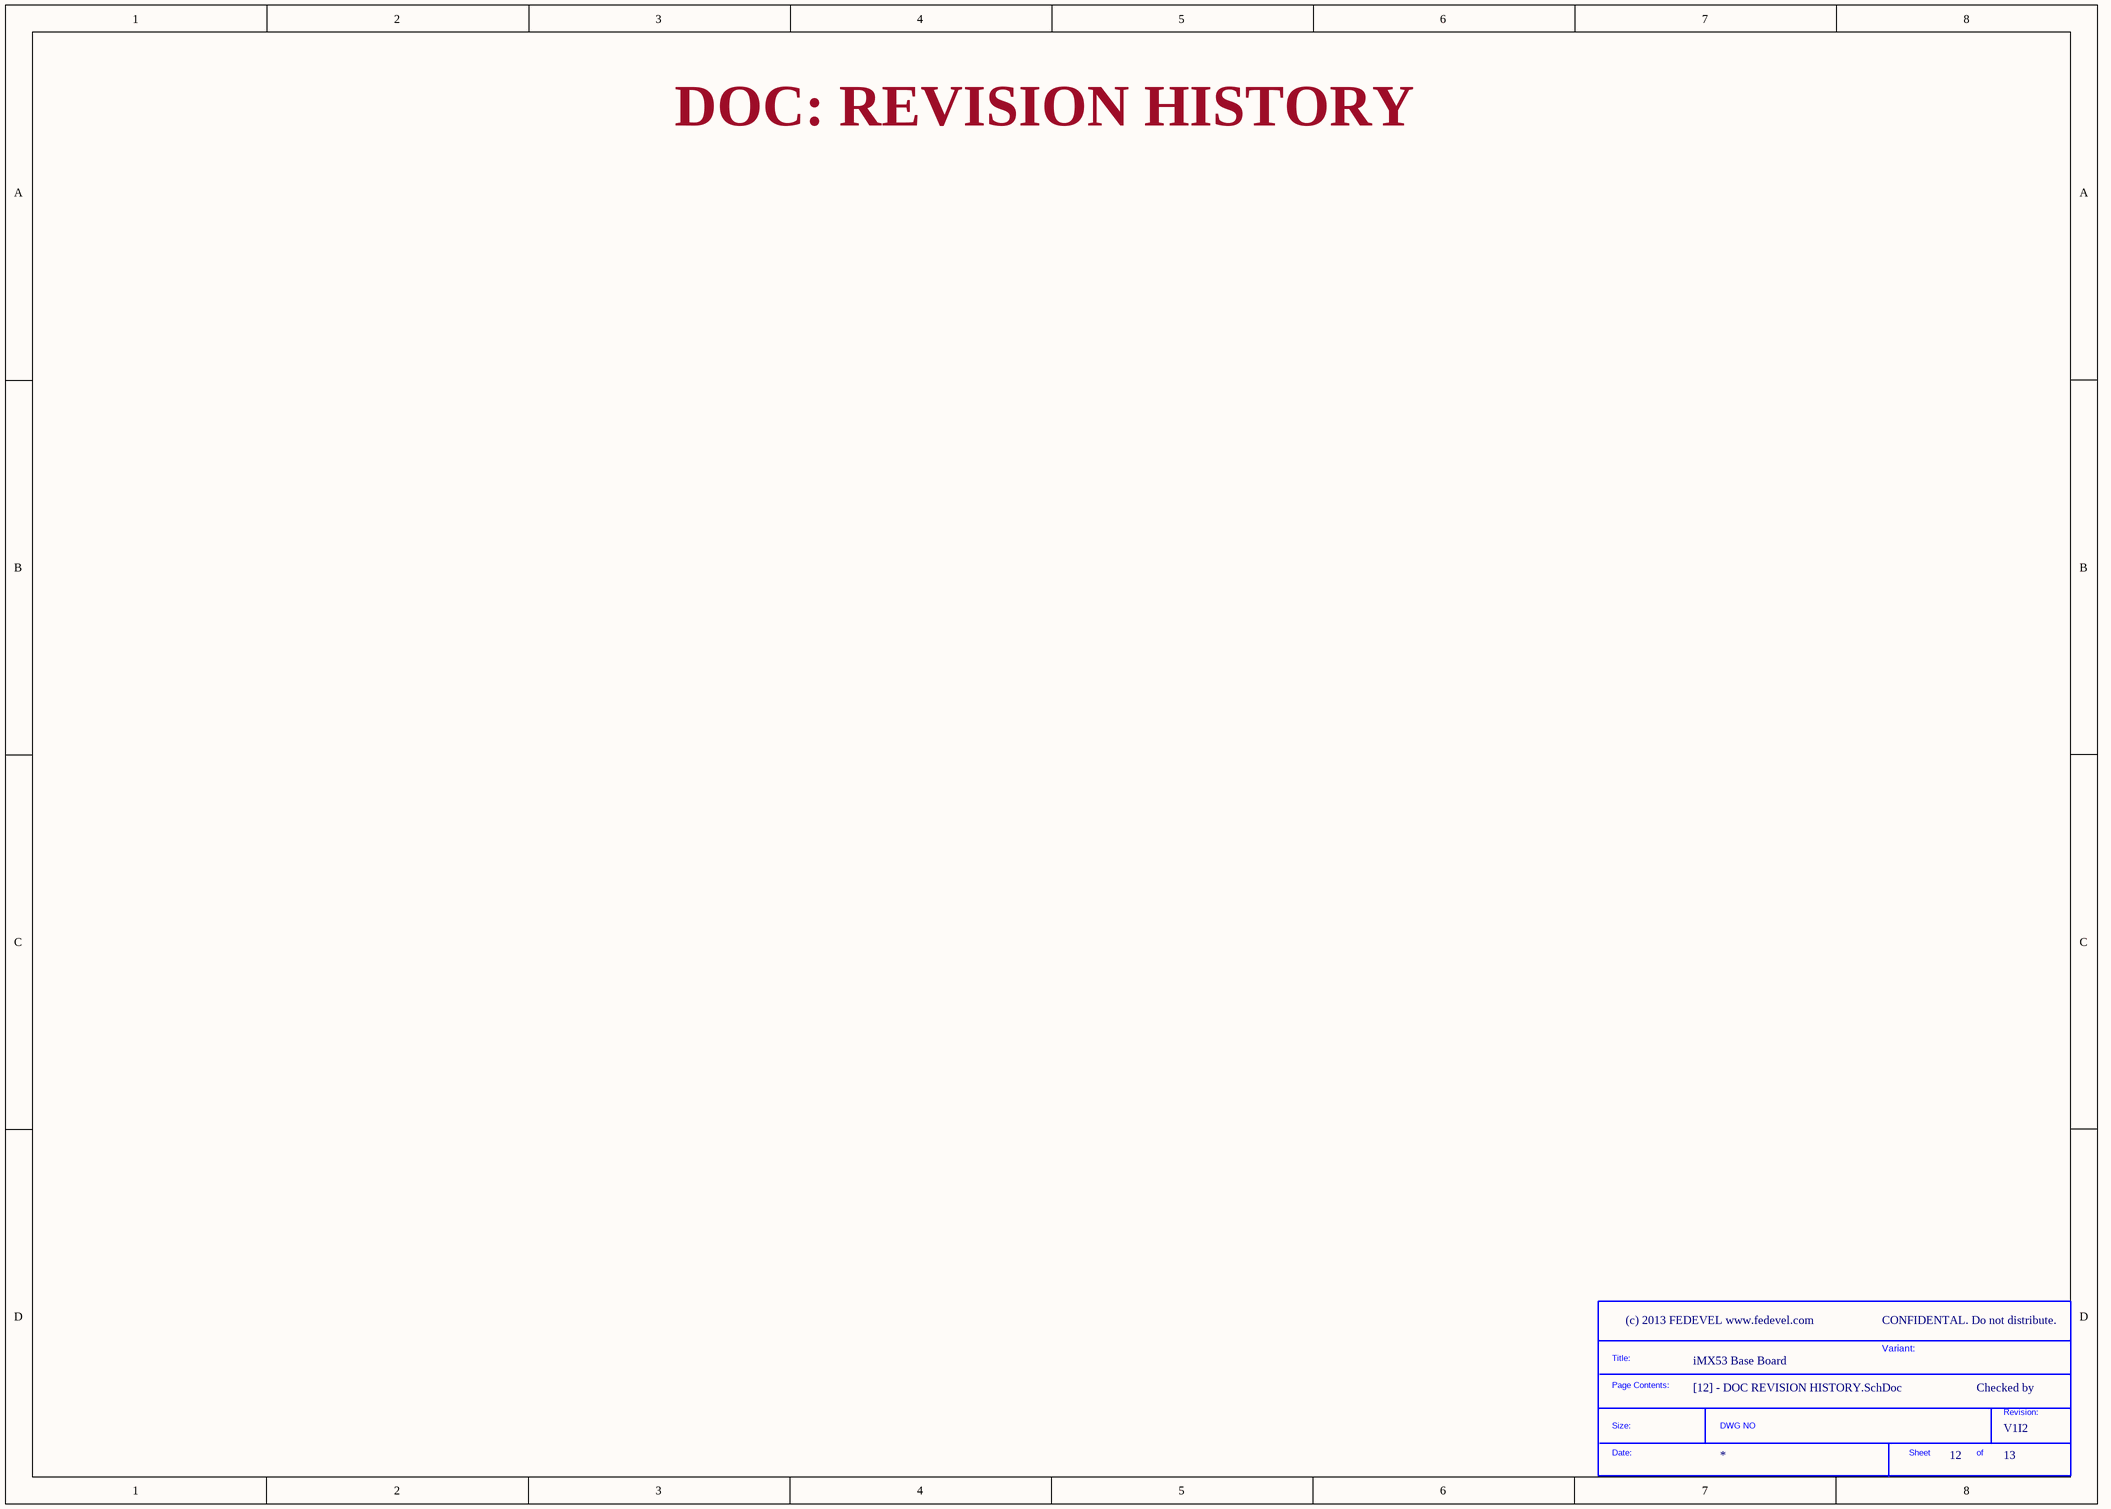
[diagram p12: [12] - DOC REVISION HISTORY.SchDoc]

### Parts
(Parts that share a designator on the sheet are numbered #1, #2 ... from top to bottom, then left to right.)
*#4  SDTitleBlock  (value not drawn)  (graphical)

### Notes on the sheet
- DOC: REVISION HISTORY
- CONFIDENTAL. Do not distribute.
- CLOCKS (CPU & PCIE)
- Variant:
- Checked by
- (in symbol SDTitleBlock) Title:; Page Contents:; Revision:; Size:; DWG NO; Date:; Sheet; of

## Nets that join several sheets
3V3: [03] - DIMM CON (12 pins), [04] - LCD, VGA (R4.1 TP7.1), [05] - AUDIO (R20.1 TP9.1), [06] - USB (R46.1 TP11.1), [07] - RS232 (R66.1 R67.1 TP13.1 TP15.1), [08] - MMC SLOT (6 pins), [09] - DVI (8 pins), [10] - ETHERNET (R126.1 TP25.1), [11] - POWERS (C216.2 J14.2 U38.8)
5V: [03] - DIMM CON (6 pins), [04] - LCD, VGA (12 pins), [05] - AUDIO (C43.2 C44.2 U10.1 U10.3), [06] - USB (7 pins), [09] - DVI (5 pins), [10] - ETHERNET (5 pins), [11] - POWERS (6 pins)
GND: [03] - DIMM CON (55 pins), [04] - LCD, VGA (55 pins), [05] - AUDIO (36 pins), [06] - USB (55 pins), [07] - RS232 (30 pins), [08] - MMC SLOT (61 pins), [09] - DVI (49 pins), [10] - ETHERNET (17 pins), [11] - POWERS (52 pins)
PHY_VDDA: [03] - DIMM CON (H4.5 K1.22), [10] - ETHERNET (J12.10 J12.12 R140.2)
VBUP: [03] - DIMM CON (H2.3 K1.13), [05] - AUDIO (U14.7), [11] - POWERS (9 pins)
VIO: [03] - DIMM CON (8 pins), [04] - LCD, VGA (12 pins), [05] - AUDIO (C46.2 R32.1 U11.2 U11.10), [06] - USB (R47.1 R51.1), [07] - RS232 (9 pins), [08] - MMC SLOT (13 pins), [09] - DVI (C177.2 R124.1 R125.1 U32.2), [11] - POWERS (R158.2)
VSB: [04] - LCD, VGA (5 pins), [11] - POWERS (7 pins)
#CAN_CS_3V3: [07] - RS232 (U21.13), [10] - ETHERNET (U33.16)
#CAN_INT_3V3: [07] - RS232 (U19.9), [10] - ETHERNET (U33.12)
#PENIRQ_3V3: [05] - AUDIO (U14.11), [07] - RS232 (U19.10)
#POR: [03] - DIMM CON (H4.4 K1.16), [11] - POWERS (C219.2 R157.1 SW4.1)
#RESET_OUT: [03] - DIMM CON (H2.4 K1.15), [07] - RS232 (U20.14)
#RESET_OUT_3V3: [05] - AUDIO (U13.5), [06] - USB (R58.2), [07] - RS232 (H9.2 U20.10), [09] - DVI (R108.1), [10] - ETHERNET (R134.2)
#TOUCH_CS_3V3: [05] - AUDIO (U14.15), [07] - RS232 (U21.12)
#USBH1_OC: [03] - DIMM CON (H3.8 K1.28), [06] - USB (R51.2)
#USBO_OC: [03] - DIMM CON (H3.10 K1.36), [06] - USB (R47.2 U15.2 U15.3)
BIAS: [04] - LCD, VGA (H5.27 RN7.5 U3.11), [09] - DVI (U30.2)
BOOTMODE: [03] - DIMM CON (H4.2 K1.8), [11] - POWERS (H15.2)
CSPI1_MISO: [03] - DIMM CON (H2.12 K1.47), [07] - RS232 (U21.5)
CSPI1_MISO_3V3: [05] - AUDIO (U14.12), [07] - RS232 (H9.7 U21.16), [08] - MMC SLOT (U24.2), [10] - ETHERNET (U33.15)
CSPI1_MOSI: [03] - DIMM CON (H4.11 K1.46), [07] - RS232 (U21.4)
CSPI1_MOSI_3V3: [05] - AUDIO (U14.14), [07] - RS232 (H9.8 U21.17), [08] - MMC SLOT (U24.5), [10] - ETHERNET (U33.14)
CSPI1_RDY: [03] - DIMM CON (H1.13 K1.49), [07] - RS232 (U21.7)
CSPI1_RDY_3V3: [05] - AUDIO (U14.13), [07] - RS232 (H9.5 U21.14)
CSPI1_SCLK: [03] - DIMM CON (H4.12 K1.48), [07] - RS232 (U21.6)
CSPI1_SCLK_3V3: [05] - AUDIO (U14.16), [07] - RS232 (H9.10 U21.15), [08] - MMC SLOT (U24.6), [10] - ETHERNET (U33.13)
CSPI1_SS0: [03] - DIMM CON (H3.12 K1.44), [07] - RS232 (U21.1)
CSPI1_SS0_3V3: [07] - RS232 (H9.3 U21.20), [08] - MMC SLOT (R75.1)
CSPI1_SS1: [03] - DIMM CON (H2.11 K1.45), [07] - RS232 (U21.3)
CSPI1_SS1_3V3: [07] - RS232 (H9.4 U21.18), [08] - MMC SLOT (R76.1)
DISP1_DAT0: [03] - DIMM CON (H2.29 K1.117), [04] - LCD, VGA (U2.3)
DISP1_DAT1: [03] - DIMM CON (H4.29 K1.118), [04] - LCD, VGA (U2.4)
DISP1_DAT2: [03] - DIMM CON (H2.30 K1.119), [04] - LCD, VGA (U2.5)
DISP1_DAT3: [03] - DIMM CON (H4.30 K1.120), [04] - LCD, VGA (U2.6)
DISP1_DAT4: [03] - DIMM CON (H1.31 K1.121), [04] - LCD, VGA (U2.7)
DISP1_DAT5: [03] - DIMM CON (H3.31 K1.122), [04] - LCD, VGA (U2.8)
DISP1_DAT6: [03] - DIMM CON (H1.32 K1.123), [04] - LCD, VGA (U2.9)
DISP1_DAT7: [03] - DIMM CON (H3.32 K1.124), [04] - LCD, VGA (U2.10)
DISP1_DAT8: [03] - DIMM CON (H2.31 K1.125), [04] - LCD, VGA (U5.3)
DISP1_DAT9: [03] - DIMM CON (H4.31 K1.126), [04] - LCD, VGA (U5.4)
DISP1_DAT10: [03] - DIMM CON (H2.32 K1.127), [04] - LCD, VGA (U5.5)
DISP1_DAT11: [03] - DIMM CON (H4.32 K1.128), [04] - LCD, VGA (U5.6)
DISP1_DAT12: [03] - DIMM CON (H3.33 K1.130), [04] - LCD, VGA (U5.7)
DISP1_DAT13: [03] - DIMM CON (H1.34 K1.131), [04] - LCD, VGA (U5.8)
DISP1_DAT14: [03] - DIMM CON (H3.34 K1.132), [04] - LCD, VGA (U5.9)
DISP1_DAT15: [03] - DIMM CON (H2.33 K1.133), [04] - LCD, VGA (U5.10)
DISP1_DAT16: [03] - DIMM CON (H4.33 K1.134), [04] - LCD, VGA (U7.3)
DISP1_DAT17: [03] - DIMM CON (H2.34 K1.135), [04] - LCD, VGA (U7.4)
DISP1_DAT18: [03] - DIMM CON (H4.34 K1.136), [04] - LCD, VGA (U7.5)
DISP1_DAT19: [03] - DIMM CON (H1.35 K1.137), [04] - LCD, VGA (U7.6)
DISP1_DAT20: [03] - DIMM CON (H3.35 K1.138), [04] - LCD, VGA (U7.7)
DISP1_DAT21: [03] - DIMM CON (H1.36 K1.139), [04] - LCD, VGA (U7.8)
DISP1_DAT22: [03] - DIMM CON (H3.36 K1.140), [04] - LCD, VGA (U7.9)
DISP1_DAT23: [03] - DIMM CON (H2.35 K1.141), [04] - LCD, VGA (U7.10)
DISP1_HSYNC: [03] - DIMM CON (H2.36 K1.143), [04] - LCD, VGA (U9.4)
DISP1_OE_ACD: [03] - DIMM CON (H1.37 K1.145), [04] - LCD, VGA (U9.6)
DISP1_SCLK: [03] - DIMM CON (H3.37 K1.146), [04] - LCD, VGA (U9.5)
DISP1_VSYNC: [03] - DIMM CON (H4.36 K1.144), [04] - LCD, VGA (U9.3)
FCLK: [04] - LCD, VGA (H5.4 RN7.8 U8.3), [09] - DVI (U30.5)
HSI2C_CLK: [03] - DIMM CON (H1.11 K1.41), [09] - DVI (R124.2 U32.3)
HSI2C_DAT: [03] - DIMM CON (H4.10 K1.40), [09] - DVI (R125.2 U32.4)
I2C_INT: [07] - RS232 (U19.8), [11] - POWERS (U37.7)
I2C_SCL: [05] - AUDIO (U12.29 U13.7), [06] - USB (R57.2), [08] - MMC SLOT (U25.6), [09] - DVI (5 pins), [11] - POWERS (U37.8 U38.6)
I2C_SDA: [05] - AUDIO (U12.27 U13.8), [06] - USB (R56.2), [08] - MMC SLOT (U25.5), [09] - DVI (5 pins), [11] - POWERS (U37.9 U38.5)
IR_RXD: [04] - LCD, VGA (R8.2 T1.2 U1.4), [11] - POWERS (U37.4)
IR_TXD: [04] - LCD, VGA (U1.3), [11] - POWERS (U37.3)
KEY_COL1: [03] - DIMM CON (H1.19 K1.73), [11] - POWERS (D5.3)
KEY_COL3: [03] - DIMM CON (H1.20 K1.75), [11] - POWERS (D6.3)
KEY_ROW0: [03] - DIMM CON (H2.19 K1.77), [11] - POWERS (SW2.1 SW2.3 SW3.1 SW3.3)
KEY_ROW2: [03] - DIMM CON (H2.20 K1.79), [11] - POWERS (SW5.1 SW5.3 SW6.1 SW6.3)
LAN45: [10] - ETHERNET (J12.4 J12.5 R145.2), [11] - POWERS (L56.1)
LAN78: [10] - ETHERNET (J12.7 J12.8 R146.2), [11] - POWERS (L58.1)
LCLK: [04] - LCD, VGA (H5.3 RN7.7 U8.1), [09] - DVI (U30.4)
LDD0: [04] - LCD, VGA (RN1.8 U3.16), [09] - DVI (U30.63)
LDD1: [04] - LCD, VGA (RN1.7 U3.17), [09] - DVI (U30.62)
LDD2: [04] - LCD, VGA (H5.20 RN1.6 U3.18), [09] - DVI (U30.61)
LDD3: [04] - LCD, VGA (H5.21 RN1.5 U3.19), [09] - DVI (U30.60)
LDD4: [04] - LCD, VGA (H5.22 RN2.8 U3.20), [09] - DVI (U30.59)
LDD5: [04] - LCD, VGA (H5.23 RN2.7 U3.21), [09] - DVI (U30.58)
LDD6: [04] - LCD, VGA (H5.24 RN2.6 U3.22), [09] - DVI (U30.55)
LDD7: [04] - LCD, VGA (H5.25 RN2.5 U3.23), [09] - DVI (U30.54)
LDD8: [04] - LCD, VGA (RN3.8 U3.3), [09] - DVI (U30.53)
LDD9: [04] - LCD, VGA (RN3.7 U3.4), [09] - DVI (U30.52)
LDD10: [04] - LCD, VGA (H5.13 RN3.6 U3.5), [09] - DVI (U30.51)
LDD11: [04] - LCD, VGA (H5.14 RN3.5 U3.6), [09] - DVI (U30.50)
LDD12: [04] - LCD, VGA (H5.15 RN4.8 U3.7), [09] - DVI (U30.47)
LDD13: [04] - LCD, VGA (H5.16 RN4.7 U3.8), [09] - DVI (U30.46)
LDD14: [04] - LCD, VGA (H5.17 RN4.6 U3.9), [09] - DVI (U30.45)
LDD15: [04] - LCD, VGA (H5.18 RN4.5 U3.10), [09] - DVI (U30.44)
LDD16: [04] - LCD, VGA (RN5.8 U3.41), [09] - DVI (U30.43)
LDD17: [04] - LCD, VGA (RN5.7 U3.42), [09] - DVI (U30.42)
LDD18: [04] - LCD, VGA (H5.6 RN5.6 U3.43), [09] - DVI (U30.41)
LDD19: [04] - LCD, VGA (H5.7 RN5.5 U3.44), [09] - DVI (U30.40)
LDD20: [04] - LCD, VGA (H5.8 RN6.8 U3.45), [09] - DVI (U30.39)
LDD21: [04] - LCD, VGA (H5.9 RN6.7 U3.46), [09] - DVI (U30.38)
LDD22: [04] - LCD, VGA (H5.10 RN6.6 U3.47), [09] - DVI (U30.37)
LDD23: [04] - LCD, VGA (H5.11 RN6.5 U3.48), [09] - DVI (U30.36)
OSC32KHZ: [05] - AUDIO (R28.1 U13.9), [11] - POWERS (U38.7)
OWIRE: [03] - DIMM CON (H1.12 K1.43), [08] - MMC SLOT (R84.2 U26.1)
PCLK: [04] - LCD, VGA (H5.2 RN7.6 U3.24), [09] - DVI (U30.57)
PHY_ACT: [03] - DIMM CON (H4.6 K1.24), [10] - ETHERNET (R144.1)
PHY_LINK: [03] - DIMM CON (H3.6 K1.20), [10] - ETHERNET (R141.1)
PHY_RXN: [03] - DIMM CON (K1.23), [10] - ETHERNET (TR1.9)
PHY_RXP: [03] - DIMM CON (K1.25), [10] - ETHERNET (TR1.11)
PHY_TXN: [03] - DIMM CON (K1.19), [10] - ETHERNET (TR1.14)
PHY_TXP: [03] - DIMM CON (K1.21), [10] - ETHERNET (TR1.16)
PLED: [04] - LCD, VGA (R19.1 T4.1), [11] - POWERS (U37.2)
POWER_ON: [03] - DIMM CON (H4.3 K1.14), [11] - POWERS (R154.1 T7.3 U35.3)
PSAVE: [04] - LCD, VGA (H5.29 RN8.5 U3.38), [09] - DVI (U30.10)
PWM: [03] - DIMM CON (H3.11 K1.42), [04] - LCD, VGA (U9.7)
SCR_RESET: [07] - RS232 (U20.9), [08] - MMC SLOT (U28.28)
SCR_RXD: [07] - RS232 (U20.7), [08] - MMC SLOT (R87.1)
SCR_TXD: [07] - RS232 (U19.7), [08] - MMC SLOT (R88.1)
SD1_CD: [03] - DIMM CON (H1.14 K1.51), [08] - MMC SLOT (J7.10 R85.2)
SD1_CLK: [03] - DIMM CON (H1.15 K1.57), [08] - MMC SLOT (U27.3)
SD1_CMD: [03] - DIMM CON (H4.14 K1.56), [08] - MMC SLOT (U27.1)
SD1_DATA0: [03] - DIMM CON (H3.14 K1.52), [08] - MMC SLOT (U27.4)
SD1_DATA1: [03] - DIMM CON (H2.13 K1.53), [08] - MMC SLOT (U27.5)
SD1_DATA2: [03] - DIMM CON (H4.13 K1.54), [08] - MMC SLOT (U27.6)
SD1_DATA3: [03] - DIMM CON (H2.14 K1.55), [08] - MMC SLOT (U27.7)
SD2_CD: [03] - DIMM CON (H2.24 K1.95), [08] - MMC SLOT (J9.10 R97.2)
SD2_CLK: [03] - DIMM CON (H2.25 K1.101), [08] - MMC SLOT (U29.3)
SD2_CMD: [03] - DIMM CON (H3.26 K1.100), [08] - MMC SLOT (U29.1)
SD2_DATA0: [03] - DIMM CON (H4.24 K1.96), [08] - MMC SLOT (U29.4)
SD2_DATA1: [03] - DIMM CON (H1.25 K1.97), [08] - MMC SLOT (U29.5)
SD2_DATA2: [03] - DIMM CON (H3.25 K1.98), [08] - MMC SLOT (U29.6)
SD2_DATA3: [03] - DIMM CON (H1.26 K1.99), [08] - MMC SLOT (U29.7)
SSI1_CLK: [03] - DIMM CON (H4.21 K1.86), [05] - AUDIO (U11.7)
SSI1_FS: [03] - DIMM CON (H2.22 K1.87), [05] - AUDIO (U11.9)
SSI1_RXD: [03] - DIMM CON (H3.22 K1.84), [05] - AUDIO (U11.8)
SSI1_TXD: [03] - DIMM CON (H2.21 K1.85), [05] - AUDIO (U11.6)
SSI2_CLK: [03] - DIMM CON (H3.24 K1.92), [05] - AUDIO (U11.4)
SSI2_FS: [03] - DIMM CON (H2.23 K1.93), [05] - AUDIO (U11.3)
SSI2_INT: [03] - DIMM CON (H1.23 K1.89), [05] - AUDIO (U11.5)
SSI2_RXD: [03] - DIMM CON (H3.23 K1.90), [05] - AUDIO (U11.1)
TSMX: [04] - LCD, VGA (H5.37), [05] - AUDIO (R37.2)
TSMY: [04] - LCD, VGA (H5.38), [05] - AUDIO (R39.2)
TSPX: [04] - LCD, VGA (H5.39), [05] - AUDIO (R35.2)
TSPY: [04] - LCD, VGA (H5.40), [05] - AUDIO (R38.2)
UART1_CTS: [03] - DIMM CON (H4.15 K1.62), [07] - RS232 (U20.18)
UART1_RTS: [03] - DIMM CON (H2.15 K1.61), [07] - RS232 (U19.18)
UART1_RXD: [03] - DIMM CON (H3.16 K1.60), [07] - RS232 (U19.19)
UART1_TXD: [03] - DIMM CON (H1.16 K1.59), [07] - RS232 (U20.19)
UART2_CTS: [03] - DIMM CON (H3.17 K1.66), [07] - RS232 (U20.20)
UART2_RTS: [03] - DIMM CON (H1.17 K1.65), [07] - RS232 (U19.20)
UART2_RXD: [03] - DIMM CON (H4.16 K1.64), [07] - RS232 (U19.21)
UART2_TXD: [03] - DIMM CON (H2.16 K1.63), [07] - RS232 (U20.21)
UART3_RXD: [03] - DIMM CON (H3.18 K1.68), [07] - RS232 (U19.17)
UART3_TXD: [03] - DIMM CON (H1.18 K1.67), [07] - RS232 (U20.17)
USBH1_DM: [03] - DIMM CON (K1.29), [06] - USB (U18.30)
USBH1_DP: [03] - DIMM CON (K1.31), [06] - USB (U18.31)
USBH1_VBUS: [03] - DIMM CON (H4.7 K1.30), [06] - USB (R49.2)
USBO_D_N: [03] - DIMM CON (K1.35), [06] - USB (B1.4 J3.2)
USBO_D_P: [03] - DIMM CON (K1.37), [06] - USB (B1.2 J3.3)
USBO_ID: [03] - DIMM CON (H1.9 K1.33), [06] - USB (H8.2 J3.4)
USBO_PEN: [03] - DIMM CON (H3.9 K1.34), [07] - RS232 (U20.16)
USBO_PEN_3V3: [06] - USB (U15.1 U15.4), [07] - RS232 (U20.8)
USBO_VBUS: [03] - DIMM CON (H4.9 K1.38), [06] - USB (R48.2)
VGA_BLUE: [04] - LCD, VGA (R13.2 U3.28), [09] - DVI (J10.C3)
VGA_GREEN: [04] - LCD, VGA (R12.2 U3.32), [09] - DVI (J10.C2)
VGA_HSYNC: [04] - LCD, VGA (C34.2 L5.2), [09] - DVI (J10.C4)
VGA_RED: [04] - LCD, VGA (R11.2 U3.34), [09] - DVI (J10.C1)
VGA_VSYNC: [04] - LCD, VGA (C35.2 L6.2), [09] - DVI (J10.8)